# EasyEDA Pro project teensypixel.epro

# Schematic Adaptor Board
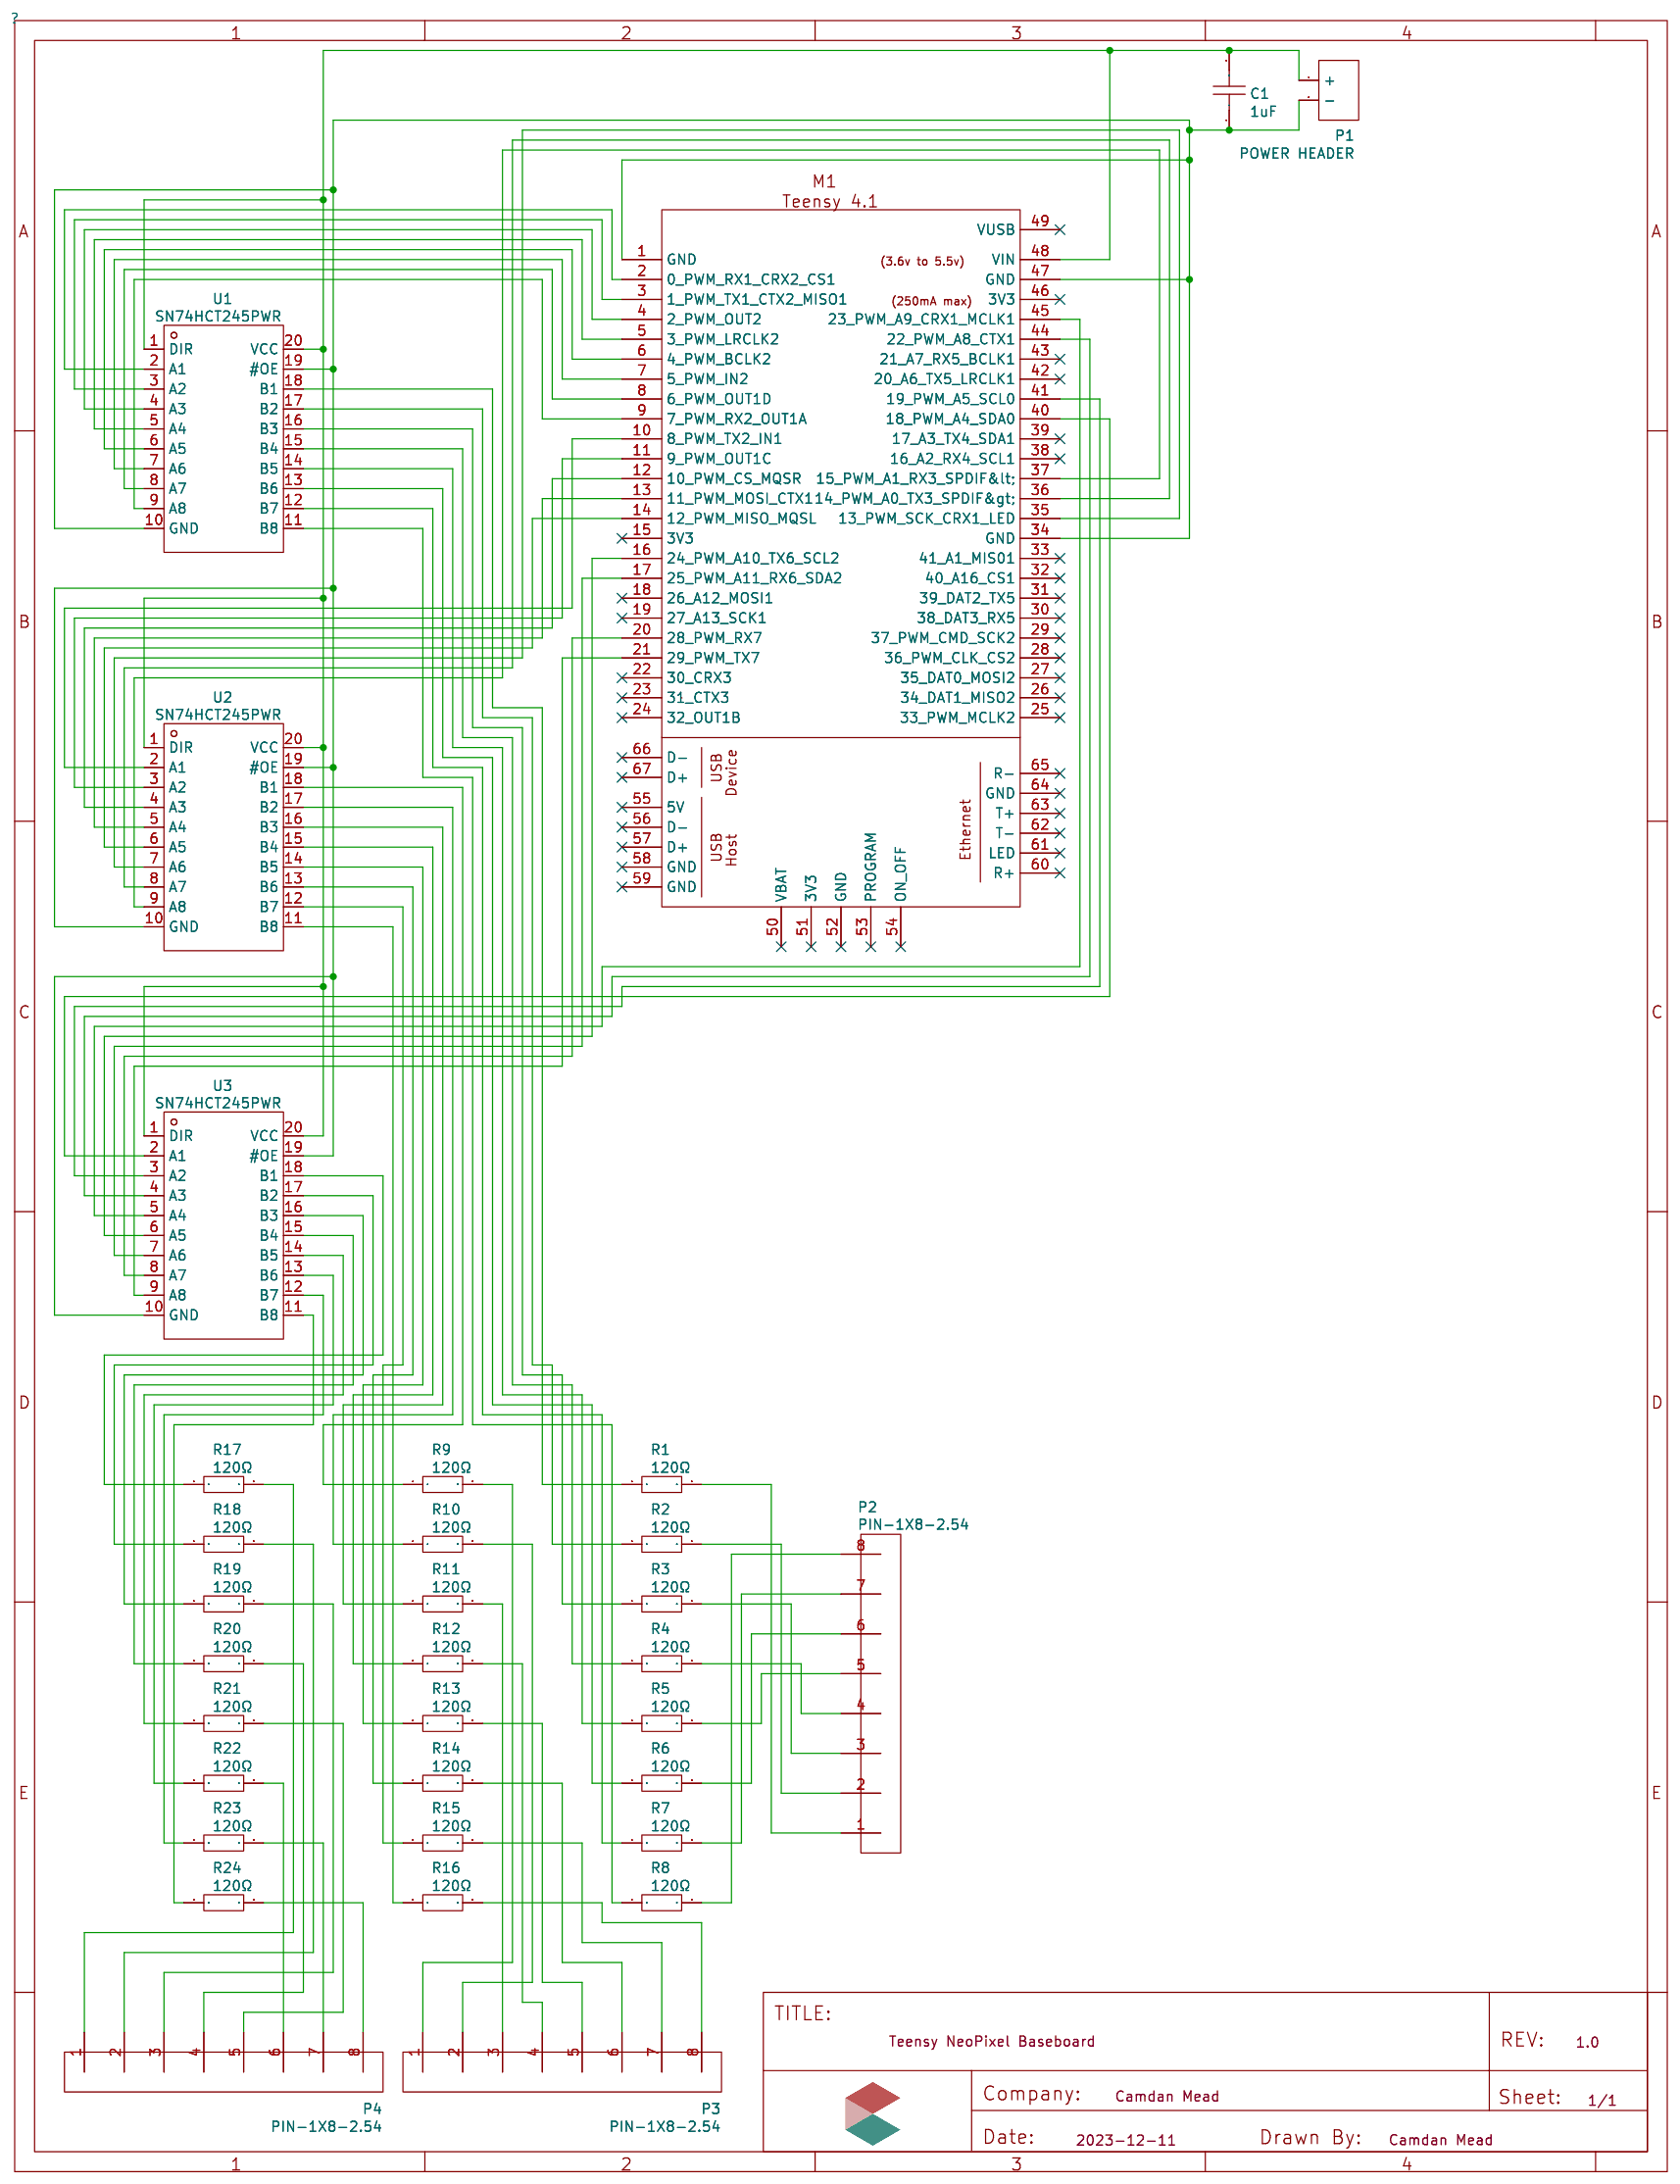
[diagram p0: schematic sheet]

## Parts
C1  1uF  [C0402]
P1  POWER HEADER  [POWER HEADER]
P2  PIN-1X8-2.54  [PIN-1X8-2.54]
P3  PIN-1X8-2.54  [PIN-1X8-2.54]
P4  PIN-1X8-2.54  [PIN-1X8-2.54]
R1  120Ω  [R0402]
R2  120Ω  [R0402]
R3  120Ω  [R0402]
R4  120Ω  [R0402]
R5  120Ω  [R0402]
R6  120Ω  [R0402]
R7  120Ω  [R0402]
R8  120Ω  [R0402]
R9  120Ω  [R0402]
R10  120Ω  [R0402]
R11  120Ω  [R0402]
R12  120Ω  [R0402]
R13  120Ω  [R0402]
R14  120Ω  [R0402]
R15  120Ω  [R0402]
R16  120Ω  [R0402]
R17  120Ω  [R0402]
R18  120Ω  [R0402]
R19  120Ω  [R0402]
R20  120Ω  [R0402]
R21  120Ω  [R0402]
R22  120Ω  [R0402]
R23  120Ω  [R0402]
R24  120Ω  [R0402]
U1  SN74HCT245PWR  [TSSOP-20_L6.5-W4.4-P0.65-LS6.4-BL]
U2  SN74HCT245PWR  [TSSOP-20_L6.5-W4.4-P0.65-LS6.4-BL]
U3  SN74HCT245PWR  [TSSOP-20_L6.5-W4.4-P0.65-LS6.4-BL]
U4  Teensy4.1 - KB

## Library data of the parts
C1 = 1uF: Supplier: LCSC; Manufacturer: SAMSUNG(三星); Manufacturer Part: CL05A105KA5NQNC; Supplier Part: C52923; JLCPCB Part Class: Basic Part
P1 = POWER HEADER: Supplier: LCSC; Manufacturer: BOOMELE; Manufacturer Part: 2.54-1*2PFemale; image: //image.lceda.cn/szlcsc/C49661.jpg; Supplier Part: C49661
P2-P4 = PIN-1X8-2.54
R1-R24 = 120Ω: Supplier: LCSC; Manufacturer: UNI-ROYAL(厚声); Manufacturer Part: 0402WGF1200TCE; Supplier Part: C25079; JLCPCB Part Class: Basic Part
U1-U3 = SN74HCT245PWR: Supplier: LCSC; Manufacturer: TI(德州仪器); Supplier Part: C6779; JLCPCB Part Class: Extended Part
U4 = Teensy4.1 - KB: Manufacturer: PJRC; Manufacturer Part: Teensy4.1; link: https://www.pjrc.com/store/teensy41.html

## Nets
Net-(C1-1): C1.1 P1.2(-) U1.10(GND) U1.19(#OE) U2.10(GND) U2.19(#OE) U3.10(GND) U3.19(#OE) U4.1(GND) U4.34(GND) U4.47(GND)
Net-(C1-2): C1.2 P1.1(+) U1.1(DIR) U1.20(VCC) U2.1(DIR) U2.20(VCC) U3.1(DIR) U3.20(VCC) U4.48(VIN)
Net-(P2-1): P2.1 R1.2
Net-(P2-2): P2.2 R2.2
Net-(P2-3): P2.3 R3.2
Net-(P2-4): P2.4 R4.2
Net-(P2-5): P2.5 R5.2
Net-(P2-6): P2.6 R6.2
Net-(P2-7): P2.7 R7.2
Net-(P2-8): P2.8 R8.2
Net-(P3-1): P3.1 R9.2
Net-(P3-2): P3.2 R10.2
Net-(P3-3): P3.3 R11.2
Net-(P3-4): P3.4 R12.2
Net-(P3-5): P3.5 R13.2
Net-(P3-6): P3.6 R14.2
Net-(P3-7): P3.7 R15.2
Net-(P3-8): P3.8 R16.2
Net-(P4-1): P4.1 R17.2
Net-(P4-2): P4.2 R18.2
Net-(P4-3): P4.3 R19.2
Net-(P4-4): P4.4 R20.2
Net-(P4-5): P4.5 R21.2
Net-(P4-6): P4.6 R22.2
Net-(P4-7): P4.7 R23.2
Net-(P4-8): P4.8 R24.2
Net-(U1-2): U1.2(A1) U4.2(0_PWM_RX1_CRX2_CS1)
Net-(U1-3): U1.3(A2) U4.3(1_PWM_TX1_CTX2_MISO1)
Net-(U1-4): U1.4(A3) U4.4(2_PWM_OUT2)
Net-(U1-5): U1.5(A4) U4.5(3_PWM_LRCLK2)
Net-(U1-6): U1.6(A5) U4.6(4_PWM_BCLK2)
Net-(U1-7): U1.7(A6) U4.7(5_PWM_IN2)
Net-(U1-8): U1.8(A7) U4.8(6_PWM_OUT1D)
Net-(U1-9): U1.9(A8) U4.9(7_PWM_RX2_OUT1A)
Net-(U2-2): U2.2(A1) U4.10(8_PWM_TX2_IN1)
Net-(U2-3): U2.3(A2) U4.11(9_PWM_OUT1C)
Net-(U2-4): U2.4(A3) U4.12(10_PWM_CS_MQSR)
Net-(U2-5): U2.5(A4) U4.13(11_PWM_MOSI_CTX1)
Net-(U2-6): U2.6(A5) U4.14(12_PWM_MISO_MQSL)
Net-(U2-7): U2.7(A6) U4.35(13_PWM_SCK_CRX1_LED)
Net-(U2-8): U2.8(A7) U4.36(14_PWM_A0_TX3_SPDIF&gt;)
Net-(U2-9): U2.9(A8) U4.37(15_PWM_A1_RX3_SPDIF&lt;)
Net-(U3-2): U3.2(A1) U4.40(18_PWM_A4_SDA0)
Net-(U3-3): U3.3(A2) U4.41(19_PWM_A5_SCL0)
Net-(U3-4): U3.4(A3) U4.44(22_PWM_A8_CTX1)
Net-(U3-5): U3.5(A4) U4.45(23_PWM_A9_CRX1_MCLK1)
Net-(U3-6): U3.6(A5) U4.16(24_PWM_A10_TX6_SCL2)
Net-(U3-7): U3.7(A6) U4.17(25_PWM_A11_RX6_SDA2)
Net-(U3-8): U3.8(A7) U4.20(28_PWM_RX7)
Net-(U3-9): U3.9(A8) U4.21(29_PWM_TX7)
U1_11: R8.1 U1.11(B8)
U1_12: R7.1 U1.12(B7)
U1_13: R6.1 U1.13(B6)
U1_14: R5.1 U1.14(B5)
U1_15: R4.1 U1.15(B4)
U1_16: R3.1 U1.16(B3)
U1_17: R2.1 U1.17(B2)
U1_18: R1.1 U1.18(B1)
U2_11: R16.1 U2.11(B8)
U2_12: R15.1 U2.12(B7)
U2_13: R14.1 U2.13(B6)
U2_14: R13.1 U2.14(B5)
U2_15: R12.1 U2.15(B4)
U2_16: R11.1 U2.16(B3)
U2_17: R10.1 U2.17(B2)
U2_18: R9.1 U2.18(B1)
U3_11: R24.1 U3.11(B8)
U3_12: R23.1 U3.12(B7)
U3_13: R22.1 U3.13(B6)
U3_14: R21.1 U3.14(B5)
U3_15: R20.1 U3.15(B4)
U3_16: R19.1 U3.16(B3)
U3_17: R18.1 U3.17(B2)
U3_18: R17.1 U3.18(B1)

Not connected (* = marked no-connect by the designer): U4 15(3V3)* 18(26_A12_MOSI1)* 19(27_A13_SCK1)* 22(30_CRX3)* 23(31_CTX3)* 24(32_OUT1B)* 25(33_PWM_MCLK2)* 26(34_DAT1_MISO2)* 27(35_DAT0_MOSI2)* 28(36_PWM_CLK_CS2)* 29(37_PWM_CMD_SCK2)* 30(38_DAT3_RX5)* 31(39_DAT2_TX5)* 32(40_A16_CS1)* 33(41_A1_MIS01)* 38(16_A2_RX4_SCL1)* 39(17_A3_TX4_SDA1)* 42(20_A6_TX5_LRCLK1)* 43(21_A7_RX5_BCLK1)* 46(3V3)* 49(VUSB)* 50(VBAT)* 51(3V3)* 52(GND)* 53(PROGRAM)* 54(ON_OFF)* 55(5V)* 56(D-)* 57(D+)* 58(GND)* 59(GND)* 60(R+)* 61(LED)* 62(T-)* 63(T+)* 64(GND)* 65(R-)* 66(D-)* 67(D+)*

# Schematic Adaptor Board rev 2
Create Date: 2025-02-11; Page Name: P1; Project Name: Teensy NeoPixel Baseboard; Schematic Name: Adaptor Board rev 2; Update Date: 2025-02-12; Company: Camdan Mead; Page Size: Letter; Version: V2.0
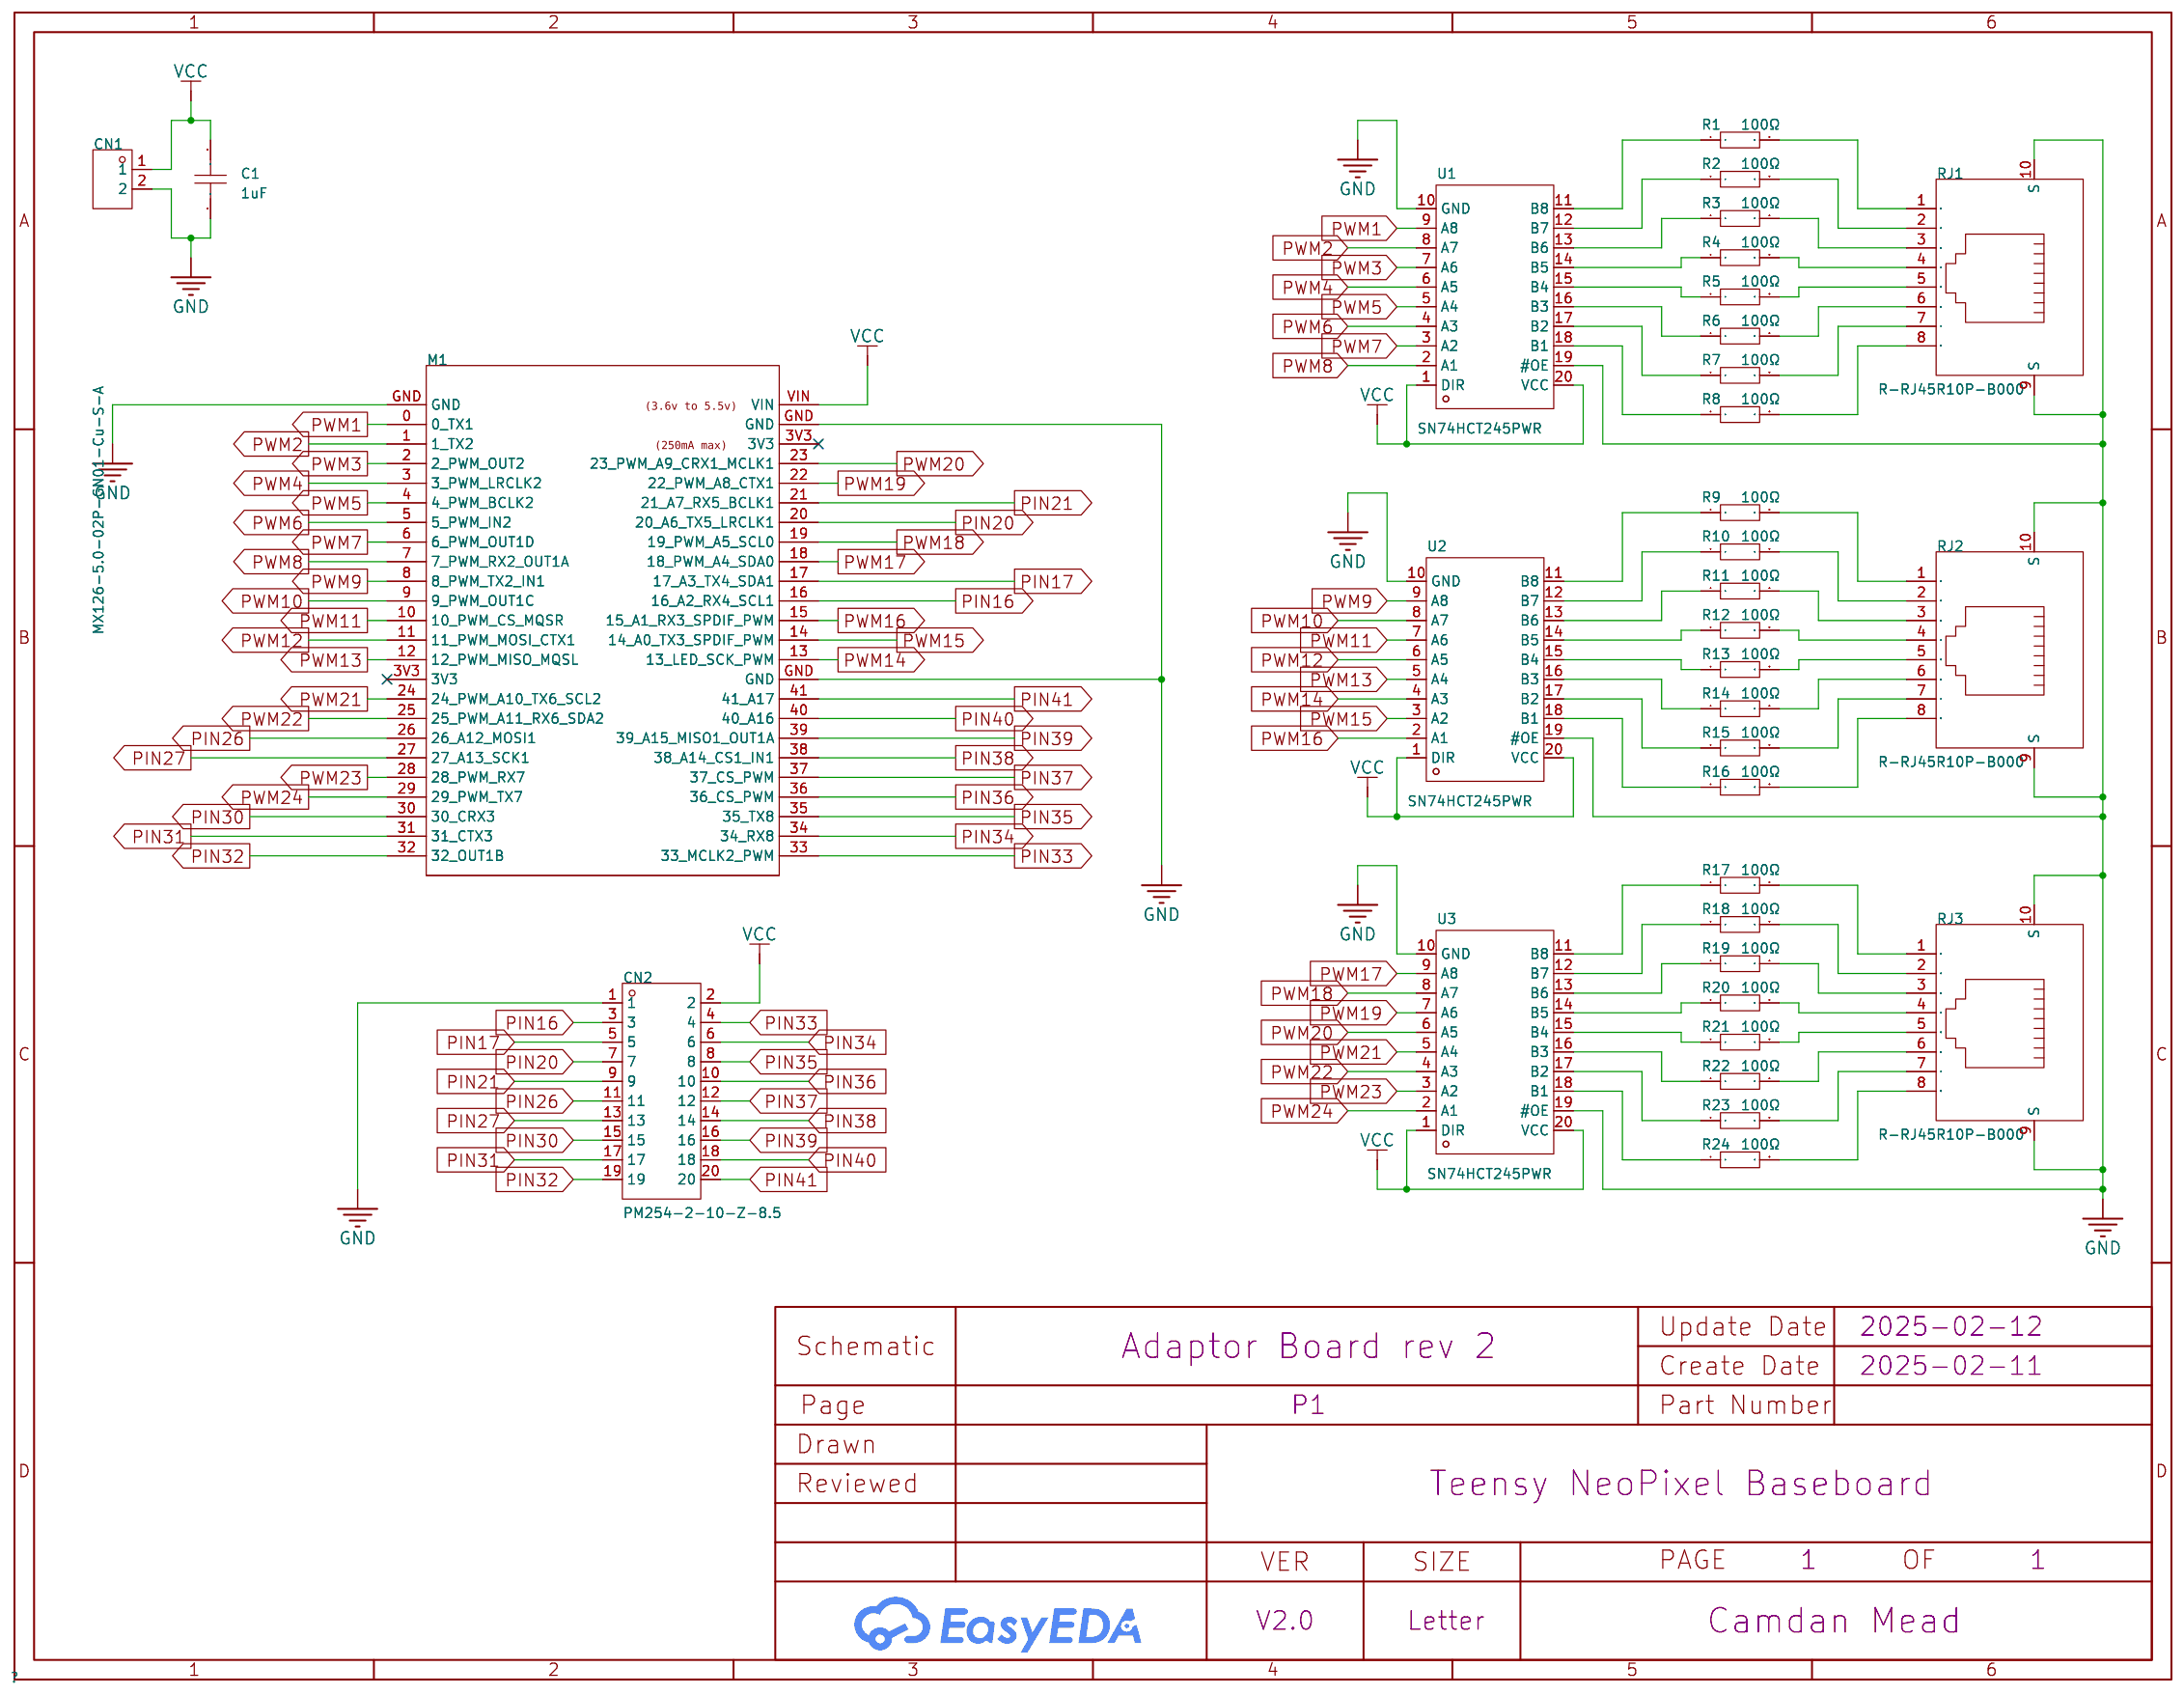
[diagram p1: schematic sheet]

## Parts
C1  1uF  [C0603]
CN1  MX126-5.0-02P-GN01-Cu-S-A  [CONN-TH_2P-P5.00_MX126-5.0-GN01-02P-CU-S-A]
CN2  PM254-2-10-Z-8.5  [HDR-TH_20P-P2.54-V-F-R2-C10-S2.54]
M1  -  [TEENSY4.1 - KBB]
R1  100Ω  [R0402]
R2  100Ω  [R0402]
R3  100Ω  [R0402]
R4  100Ω  [R0402]
R5  100Ω  [R0402]
R6  100Ω  [R0402]
R7  100Ω  [R0402]
R8  100Ω  [R0402]
R9  100Ω  [R0402]
R10  100Ω  [R0402]
R11  100Ω  [R0402]
R12  100Ω  [R0402]
R13  100Ω  [R0402]
R14  100Ω  [R0402]
R15  100Ω  [R0402]
R16  100Ω  [R0402]
R17  100Ω  [R0402]
R18  100Ω  [R0402]
R19  100Ω  [R0402]
R20  100Ω  [R0402]
R21  100Ω  [R0402]
R22  100Ω  [R0402]
R23  100Ω  [R0402]
R24  100Ω  [R0402]
RJ1  R-RJ45R10P-B000  [RJ45-TH_R-RJ45R10P-B000]
RJ2  R-RJ45R10P-B000  [RJ45-TH_R-RJ45R10P-B000]
RJ3  R-RJ45R10P-B000  [RJ45-TH_R-RJ45R10P-B000]
U1  SN74HCT245PWR  [TSSOP-20_L6.5-W4.4-P0.65-LS6.4-BL]
U2  SN74HCT245PWR  [TSSOP-20_L6.5-W4.4-P0.65-LS6.4-BL]
U3  SN74HCT245PWR  [TSSOP-20_L6.5-W4.4-P0.65-LS6.4-BL]

## Library data of the parts
C1 = CL10A105KB8NNNC: Capacitance: Tolerance:±10% Tolerance:±10% Voltage Rated: Temperature Coefficient:; LCSC Part Name: 1uF ±10% 50V; Supplier Part: C15849; Manufacturer: SAMSUNG(三星); Supplier Footprint: 0603; JLCPCB Part Class: Basic Part; Datasheet: https://atta.szlcsc.com/upload/public/pdf/source/20160218/1457707763339.pdf; Supplier: LCSC; Tolerance: ±10%
CN1 = MX126-5.0-02P-GN01-Cu-S-A: Structure:1x2P Pitch:5mm Color:Green Mounting Style:Direct Insert Number of Pins:2P Number of Rows:1 Number of PINs Per Row:2 Screw Specification:M2.5 Current Rating (Max):10A Voltage Rating (Max):300V Wire Gauge - AWG:14~26 Wire Gauge - AWG:14~26 Wire Ga; LCSC Part Name: 1x2P 5mm 直插 排数:1 每排P数:2; Supplier Part: C5188434; Manufacturer: MAX(迈旭); Supplier Footprint: 插件,P=5mm; JLCPCB Part Class: Extended Part; Datasheet: https://atta.szlcsc.com/upload/public/pdf/source/20230914/2B012B5258BE925E2417FA81B30CB923.pdf; Supplier: LCSC; Structure: 1x2P; Pitch: 5mm; Color: Green; Mounting Style: Direct Insert; Number of Pins: 2P; Number of Rows: 1; Number of PINs Per Row: 2; Screw Specification: M2.5; Current Rating (Max): 10A; Voltage Rating (Max): 300V; Wire Gauge - AWG: 14~26; Wire Gauge - mm2: 2.5; Operating Temperature Range: -40℃~+105℃
CN2 = PM254-2-10-Z-8.5: Holes Structure:2x10P Pitch:2.54mm Row Spacing:2.54mm Circular Hole / Square Hole:Square Holes Mounting Type:Straight Number of Rows:双排 Number of Holes:20P Current Rating (Max):3A Voltage Rating (Max):- Holes Direction:Top Insulation Height:8.5mm Contact; LCSC Part Name: 2x10P 间距:2.54mm 直插; Supplier Part: C2897411; Manufacturer: HCTL(华灿天禄); Supplier Footprint: 插件,P=2.54mm; JLCPCB Part Class: Extended Part; Datasheet: https://atta.szlcsc.com/upload/public/pdf/source/20230609/3D36CA2C1BFC9FD1C3F709AD9DFEB9C2.pdf; Supplier: LCSC; Holes Structure: 2x10P; Pitch: 2.54mm; Row Spacing: 2.54mm; Circular Hole / Square Hole: Square Holes; Mounting Type: Straight; Number of Rows: 双排; Number of Holes: 20P; Current Rating (Max): 3A; Holes Direction: Top; Insulation Height: 8.5mm; Contact Material: Copper Alloy; Operating Temperature Range: -40℃~+105℃; Soldering Temperature(Max): 260℃@5S
M1 = SCHLIB_TEENSY4.1_2022-12-14
R1-R24 = 0402WGF1000TCE: Type:Thick Film Resistors Resistance: Tolerance:±1% Tolerance:±1% Power(Watts): Overload Voltage (Max): Temperature Coefficient:±200ppm/℃ Temperature Coefficient:±200ppm/℃ Operating Temperature Range:-55℃~+155℃ Operating Temperature Range:-55℃~+155℃; LCSC Part Name: 100Ω ±1% 62.5mW 厚膜电阻; Supplier Part: C25076; Manufacturer: UNI-ROYAL(厚声); Supplier Footprint: 0402; JLCPCB Part Class: Basic Part; Datasheet: https://atta.szlcsc.com/upload/public/pdf/source/20200306/C422600_1E6D84923E4A46A82E41ADD87F860B5C.pdf; Supplier: LCSC; Type: Thick Film Resistors; Tolerance: ±1%; Temperature Coefficient: ±200ppm/℃; Operating Temperature Range: -55℃~+155℃
RJ1-RJ3 = R-RJ45R10P-B000: Connector Type:RJ45Receptacle Number of Ports:1 Mounting Style:Right-Angle Shielding:有屏蔽 LED:不带LED Ratings:- Operating Temperature Range:0℃~+70℃ Operating Temperature Range:0℃~+70℃; LCSC Part Name: 弯插 不带LED; Supplier Part: C386758; Manufacturer: Ckmtw(灿科盟); Supplier Footprint: 插件; JLCPCB Part Class: Extended Part; Datasheet: https://atta.szlcsc.com/upload/public/pdf/source/20190508/C386758_8CEE26A838080B089F94E7884BE94734.pdf; Supplier: LCSC; Connector Type: RJ45Receptacle; Number of Ports: 1; Mounting Style: Right-Angle; Shielding: 有屏蔽; LED: 不带LED; Operating Temperature Range: 0℃~+70℃
U1-U3 = SN74HCT245PWR: output type:Tri-State Supply Voltage:4.5V~5.5V Supply Voltage:4.5V~5.5V Number of Elements:1 Number of Bits per Element:8 Sink Current:6mA Source Current:6mA Logic Family:74HCT Operating Temperature:-40℃~+85℃ Operating Temperature:-40℃~+85℃; Supplier Part: C6779; Manufacturer: TI(德州仪器); Supplier Footprint: TSSOP-20; JLCPCB Part Class: Extended Part; Datasheet: https://www.ti.com/cn/lit/gpn/sn74hct245; Supplier: LCSC; output type: Tri-State; Supply Voltage: 4.5V~5.5V; Number of Elements: 1; Number of Bits per Element: 8; Sink Current: 6mA; Source Current: 6mA; Logic Family: 74HCT; Operating Temperature: -40℃~+85℃

## Nets
GND: C1.1 CN1.2 CN2.1 M1.GND RJ1.9(S) RJ1.10(S) RJ2.9(S) RJ2.10(S) RJ3.9(S) RJ3.10(S) U1.10(GND) U1.19(#OE) U2.10(GND) U2.19(#OE) U3.10(GND) U3.19(#OE)
VCC: C1.2 CN1.1 CN2.2 M1.VIN U1.1(DIR) U1.20(VCC) U2.1(DIR) U2.20(VCC) U3.1(DIR) U3.20(VCC)
PIN16: CN2.3 M1.16(16_A2_RX4_SCL1)
PIN17: CN2.5 M1.17(17_A3_TX4_SDA1)
PIN20: CN2.7 M1.20(20_A6_TX5_LRCLK1)
PIN21: CN2.9 M1.21(21_A7_RX5_BCLK1)
PIN26: CN2.11 M1.26(26_A12_MOSI1)
PIN27: CN2.13 M1.27(27_A13_SCK1)
PIN30: CN2.15 M1.30(30_CRX3)
PIN31: CN2.17 M1.31(31_CTX3)
PIN32: CN2.19 M1.32(32_OUT1B)
PIN33: CN2.4 M1.33(33_MCLK2_PWM)
PIN34: CN2.6 M1.34(34_RX8)
PIN35: CN2.8 M1.35(35_TX8)
PIN36: CN2.10 M1.36(36_CS_PWM)
PIN37: CN2.12 M1.37(37_CS_PWM)
PIN38: CN2.14 M1.38(38_A14_CS1_IN1)
PIN39: CN2.16 M1.39(39_A15_MISO1_OUT1A)
PIN40: CN2.18 M1.40(40_A16)
PIN41: CN2.20 M1.41(41_A17)
PWM1: M1.0(0 TX1) U1.9(A8)
PWM2: M1.1(1 TX2) U1.8(A7)
PWM3: M1.2(2_PWM_OUT2) U1.7(A6)
PWM4: M1.3(3_PWM_LRCLK2) U1.6(A5)
PWM5: M1.4(4_PWM_BCLK2) U1.5(A4)
PWM6: M1.5(5_PWM_IN2) U1.4(A3)
PWM7: M1.6(6_PWM_OUT1D) U1.3(A2)
PWM8: M1.7(7_PWM_RX2_OUT1A) U1.2(A1)
PWM9: M1.8(8_PWM_TX2_IN1) U2.9(A8)
PWM10: M1.9(9_PWM_OUT1C) U2.8(A7)
PWM11: M1.10(10_PWM_CS_MQSR) U2.7(A6)
PWM12: M1.11(11_PWM_MOSI_CTX1) U2.6(A5)
PWM13: M1.12(12_PWM_MISO_MQSL) U2.5(A4)
PWM14: M1.13(13_LED_SCK_PWM) U2.4(A3)
PWM15: M1.14(14_A0_TX3_SPDIF_PWM) U2.3(A2)
PWM16: M1.15(15_A1_RX3_SPDIF_PWM) U2.2(A1)
PWM17: M1.18(18_PWM_A4_SDA0) U3.9(A8)
PWM18: M1.19(19_PWM_A5_SCL0) U3.8(A7)
PWM19: M1.22(22_PWM_A8_CTX1) U3.7(A6)
PWM20: M1.23(23_PWM_A9_CRX1_MCLK1) U3.6(A5)
PWM21: M1.24(24_PWM_A10_TX6_SCL2) U3.5(A4)
PWM22: M1.25(25_PWM_A11_RX6_SDA2) U3.4(A3)
PWM23: M1.28(28_PWM_RX7) U3.3(A2)
PWM24: M1.29(29_PWM_TX7) U3.2(A1)
$1N2556: R6.1 U1.16(B3)
$1N2587: R4.2 RJ1.4
$1N2597: R5.2 RJ1.5
$1N2607: R6.2 RJ1.6
$1N2633: R2.2 RJ1.2
$1N2634: R3.2 RJ1.3
$1N2643: R1.2 RJ1.1
$1N2648: R7.2 RJ1.7
$1N2658: R8.2 RJ1.8
$1N3149: R10.1 U2.12(B7)
$1N3165: R12.2 RJ2.4
$1N3169: R13.2 RJ2.5
$1N3173: R14.2 RJ2.6
$1N3177: R10.2 RJ2.2
$1N3181: R11.2 RJ2.3
$1N3185: R9.2 RJ2.1
$1N3189: R16.2 RJ2.8
$1N3193: R15.2 RJ2.7
$1N3678: R20.2 RJ3.4
$1N3682: R21.2 RJ3.5
$1N3686: R22.2 RJ3.6
$1N3690: R18.2 RJ3.2
$1N3694: R19.2 RJ3.3
$1N3698: R17.2 RJ3.1
$1N3702: R24.2 RJ3.8
$1N3706: R23.2 RJ3.7
$1N9639: R1.1 U1.11(B8)
$1N9644: R2.1 U1.12(B7)
$1N9649: R3.1 U1.13(B6)
$1N9654: R4.1 U1.14(B5)
$1N9659: R5.1 U1.15(B4)
$1N9677: R7.1 U1.17(B2)
$1N9682: R8.1 U1.18(B1)
$1N9744: R9.1 U2.11(B8)
$1N9765: R11.1 U2.13(B6)
$1N9770: R12.1 U2.14(B5)
$1N9775: R13.1 U2.15(B4)
$1N9780: R14.1 U2.16(B3)
$1N9785: R15.1 U2.17(B2)
$1N9790: R16.1 U2.18(B1)
$1N9844: R17.1 U3.11(B8)
$1N9849: R18.1 U3.12(B7)
$1N9854: R19.1 U3.13(B6)
$1N9859: R20.1 U3.14(B5)
$1N9864: R21.1 U3.15(B4)
$1N9869: R22.1 U3.16(B3)
$1N9874: R23.1 U3.17(B2)
$1N9879: R24.1 U3.18(B1)

Not connected (* = marked no-connect by the designer): M1 3V3*

# Board PCB v1
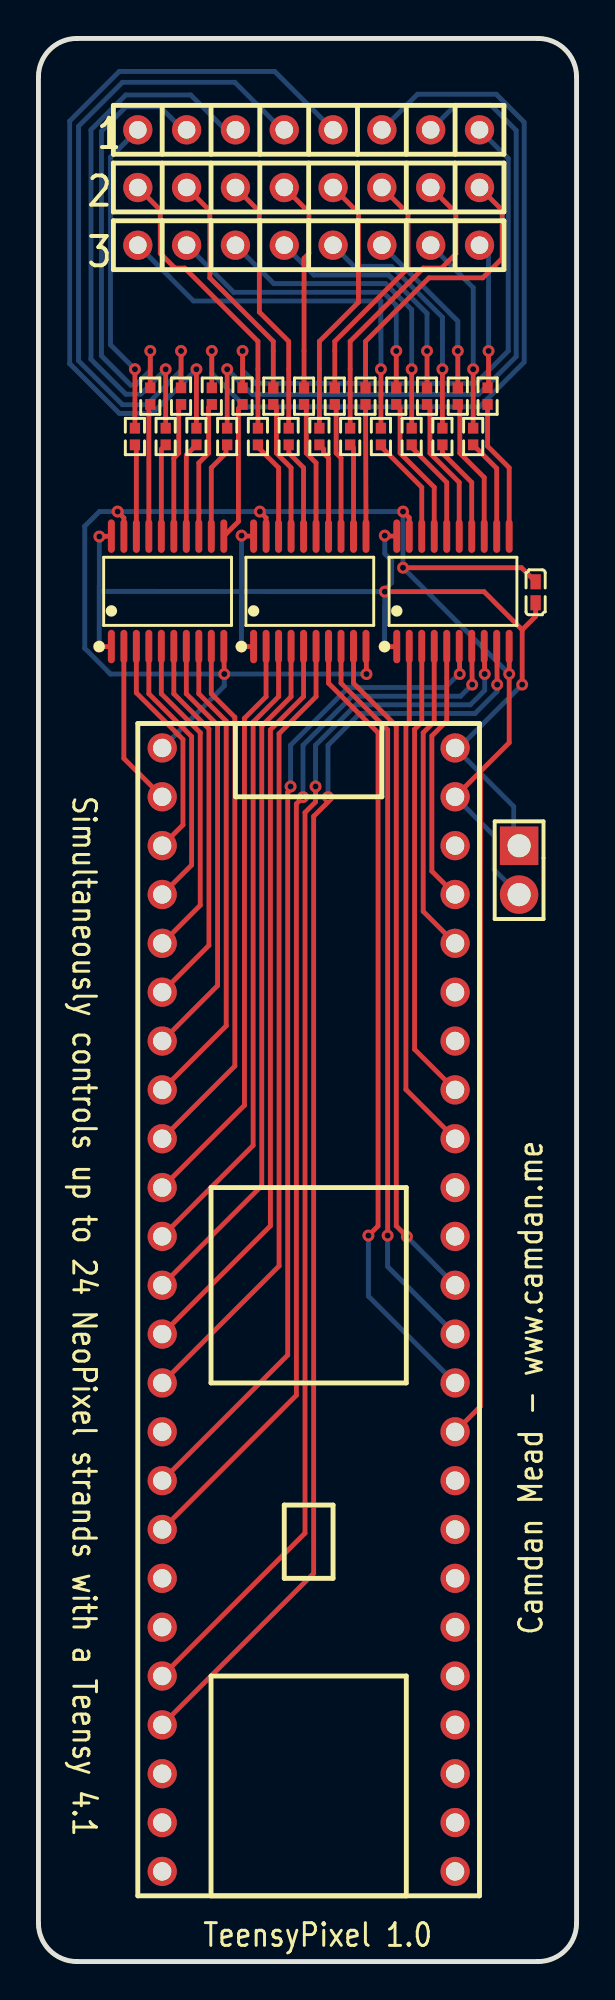
[diagram p2: board, top side]
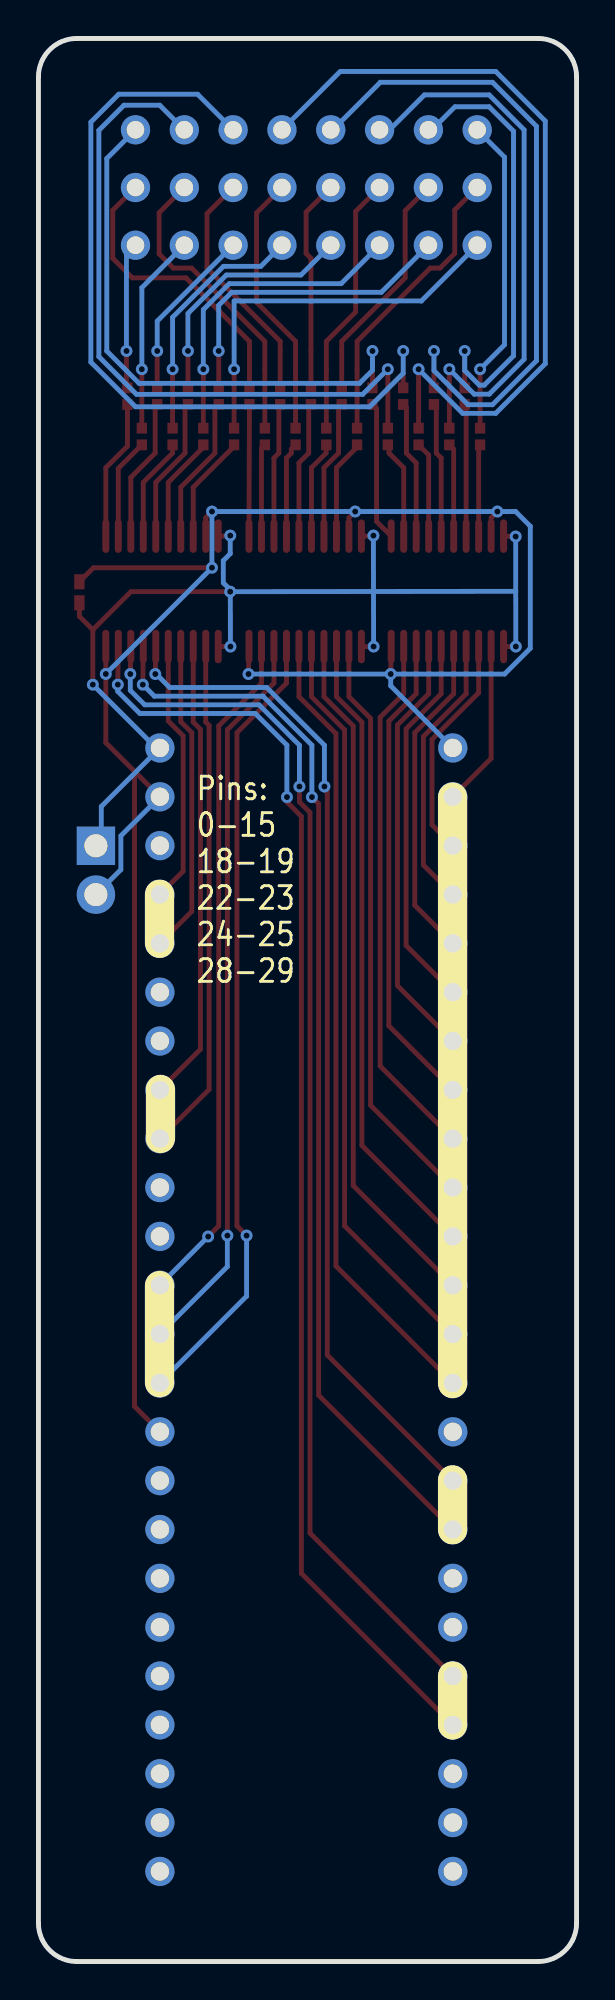
[diagram p3: board, bottom side, seen from below]

Outline 28 x 100 mm; copper layers: Top Layer, Bottom Layer. Coordinates in mm from the lower left corner of the outline.
Outline path: 0,98 arc(0.59,99.41) 2,100 26,100 arc(27.41,99.41) 28,98 28,2 arc(27.41,0.59) 26,0 2,0 arc(0.59,0.59) 0,2 0,98
Stack: Top Layer 0.035mm / Dielectric1 1.51mm FR4 er 4.5 / Bottom Layer 0.035mm

## Design rules (mm)
spacing Default (default): track to track 0.152, other pairs 0 to 0.152
track width Default (default): min 0.254, default 0.254, max 25.4
differential pair differentialPair (default): width min 0.127, default 0.254, max 2.54; gap min 0.152, default 0.152
via Default (default): diameter min 0.61, default 0.61, max 100.025; hole min 0.305, default 0.305, max 59.995

## Placement (name value [footprint] x y rotation side)
CAP  1uF  [C0402]  25.87 71.2 270 top
NOREF  -  [Pad_e915]  21.68 50.41 90 top
NOREF#2  -  [Pad_e930]  7.71 89.25 180 top
NOREF#3  -  [Pad_e916]  21.68 47.87 90 top
NOREF#4  -  [Pad_e938]  7.71 92.25 180 top
NOREF#5  -  [Pad_e933]  15.33 89.25 180 top
NOREF#6  -  [Pad_e890]  21.68 14.85 90 top
NOREF#7  -  [Pad_e914]  21.68 52.95 90 top
NOREF#8  -  [Pad_e887]  21.68 4.69 90 top
NOREF#9  -  [Pad_e912]  21.68 58.03 90 top
NOREF#10  -  [Pad_e911]  21.68 60.57 90 top
NOREF#11  -  [Pad_e932]  12.79 89.25 180 top
NOREF#12  -  [Pad_e883]  6.44 12.31 90 top
NOREF#13  -  [Pad_e929]  5.17 89.25 180 top
NOREF#14  -  [Pad_e919]  21.68 40.25 90 top
NOREF#15  -  [Pad_e921]  21.68 35.17 90 top
NOREF#16  -  [Pad_e894]  6.44 25.01 90 top
NOREF#17  -  [Pad_e895]  6.44 27.55 90 top
NOREF#18  -  [Pad_e937]  5.17 92.25 180 top
NOREF#19  -  [Pad_e888]  6.44 17.39 90 top
NOREF#20  -  [Pad_e902]  6.44 45.33 90 top
NOREF#21  -  [Pad_e918]  21.68 42.79 90 top
NOREF#22  -  [Pad_e905]  6.44 52.95 90 top
NOREF#23  -  [Pad_e909]  6.44 63.11 90 top
NOREF#24  -  [Pad_e897]  6.44 32.63 90 top
NOREF#25  -  [Pad_e892]  21.68 9.77 90 top
NOREF#26  -  [Pad_e901]  6.44 42.79 90 top
NOREF#27  -  [Pad_e931]  10.25 89.25 180 top
NOREF#28  -  [Pad_e917]  21.68 45.33 90 top
NOREF#29  -  [Pad_e928]  6.44 22.47 90 top
NOREF#30  -  [Pad_e900]  6.44 40.25 90 top
NOREF#31  -  [Pad_e944]  22.95 92.25 180 top
NOREF#32  -  [Pad_e896]  6.44 30.09 90 top
NOREF#33  -  [Pad_e942]  17.87 92.25 180 top
NOREF#34  -  [Pad_e885]  6.44 14.85 90 top
NOREF#35  -  [Pad_e881]  6.44 4.69 90 top
NOREF#36  -  [Pad_e924]  21.68 27.55 90 top
NOREF#37  -  [Pad_e882]  6.44 9.77 90 top
NOREF#38  -  [Pad_e936]  22.95 89.25 180 top
NOREF#39  -  [Pad_e925]  21.68 25.01 90 top
NOREF#40  -  [Pad_e886]  21.68 7.23 90 top
NOREF#41  -  [Pad_e927]  21.68 22.47 90 top
NOREF#42  -  [Pad_e939]  10.25 92.25 180 top
NOREF#43  -  [Pad_e908]  6.44 60.57 90 top
NOREF#44  -  [Pad_e891]  21.68 12.31 90 top
NOREF#45  -  [Pad_e910]  21.68 63.11 90 top
NOREF#46  -  [Pad_e899]  6.44 37.71 90 top
NOREF#47  -  [Pad_e903]  6.44 47.87 90 top
NOREF#48  -  [Pad_e943]  20.41 92.25 180 top
NOREF#49  -  [Pad_e904]  6.44 50.41 90 top
NOREF#50  -  [Pad_e898]  6.44 35.17 90 top
NOREF#51  -  [Pad_e922]  21.68 32.63 90 top
NOREF#52  -  [Pad_e935]  20.41 89.25 180 top
NOREF#53  -  [Pad_e884]  6.44 7.23 90 top
NOREF#54  -  [Pad_e926]  21.68 19.93 90 top
NOREF#55  -  [Pad_e940]  12.79 92.25 180 top
NOREF#56  -  [Pad_e889]  21.68 17.39 90 top
NOREF#57  -  [Pad_e934]  17.87 89.25 180 top
NOREF#58  -  [Pad_e923]  21.68 30.09 90 top
NOREF#59  -  [Pad_e941]  15.33 92.25 180 top
NOREF#60  -  [Pad_e920]  21.68 37.71 90 top
NOREF#61  -  [Pad_e913]  21.68 55.49 90 top
NOREF#62  -  [Pad_e893]  6.44 19.93 90 top
NOREF#63  -  [Pad_e907]  6.44 58.03 90 top
NOREF#64  -  [Pad_e906]  6.44 55.49 90 top
P1  POWER HEADER  [PIN-1X8-2.54]  5.17 95.25 180 top
PWR  -  [POWER HEADER]  25.01 56.75 270 top
R1  120Ω  [R0402]  5.02 79.3 90 top
R2  120Ω  [R0402]  5.82 81.4 90 top
R3  120Ω  [R0402]  6.62 79.3 90 top
R4  120Ω  [R0402]  7.42 81.4 90 top
R5  120Ω  [R0402]  8.22 79.3 90 top
R6  120Ω  [R0402]  9.02 81.4 90 top
R7  120Ω  [R0402]  9.82 79.3 90 top
R8  120Ω  [R0402]  10.62 81.4 90 top
R9  120Ω  [R0402]  11.42 79.3 90 top
R10  120Ω  [R0402]  12.22 81.4 90 top
R11  120Ω  [R0402]  13.02 79.3 90 top
R12  120Ω  [R0402]  13.82 81.4 90 top
R13  120Ω  [R0402]  14.62 79.3 90 top
R14  120Ω  [R0402]  15.42 81.4 90 top
R15  120Ω  [R0402]  16.22 79.3 90 top
R16  120Ω  [R0402]  17.02 81.4 90 top
R17  120Ω  [R0402]  17.82 79.3 90 top
R18  120Ω  [R0402]  18.62 81.4 90 top
R19  120Ω  [R0402]  19.42 79.3 90 top
R20  120Ω  [R0402]  20.22 81.4 90 top
R21  120Ω  [R0402]  21.02 79.3 90 top
R22  120Ω  [R0402]  21.82 81.4 90 top
R23  120Ω  [R0402]  22.62 79.3 90 top
R24  120Ω  [R0402]  23.37 81.4 90 top
U1  SN74HCT245PWR  [TSSOP-20_L6.5-W4.4-P0.65-LS6.4-BL]  6.72 71.25 0 top
U2  SN74HCT245PWR  [TSSOP-20_L6.5-W4.4-P0.65-LS6.4-BL]  14.12 71.25 0 top
U3  SN74HCT245PWR  [TSSOP-20_L6.5-W4.4-P0.65-LS6.4-BL]  21.57 71.25 0 top

## Footprints (pads in the part's own frame, mm; a bottom-side part is the same pattern mirrored in y, then rotated)
C0402
  rect 0.79x0.54 smd: 1(-0.545,0) 2(0.545,0)
Pad_e881
  round 1.524 hole 0.955x0.95: 24(0,0)
Pad_e882
  round 1.524 hole 0.955x0.95: 22(0,0)
Pad_e883
  round 1.524 hole 0.955x0.95: 21(0,0)
Pad_e884
  round 1.524 hole 0.955x0.95: 23(0,0)
Pad_e885
  round 1.524 hole 0.955x0.95: 20(0,0)
Pad_e886
  round 1.524 hole 0.955x0.95: 26(0,0)
Pad_e887
  round 1.524 hole 0.955x0.95: 25(0,0)
Pad_e888
  round 1.524 hole 0.955x0.95: 19(0,0)
Pad_e889
  round 1.524 hole 0.955x0.95: 30(0,0)
Pad_e890
  round 1.524 hole 0.955x0.95: 29(0,0)
Pad_e891
  round 1.524 hole 0.955x0.95: 28(0,0)
Pad_e892
  round 1.524 hole 0.955x0.95: 27(0,0)
Pad_e893
  round 1.524 hole 0.955x0.95: 18(0,0)
Pad_e894
  round 1.524 hole 0.955x0.95: 16(0,0)
Pad_e895
  round 1.524 hole 0.955x0.95: 15(0,0)
Pad_e896
  round 1.524 hole 0.955x0.95: 14(0,0)
Pad_e897
  round 1.524 hole 0.955x0.95: 13(0,0)
Pad_e898
  round 1.524 hole 0.955x0.95: 12(0,0)
Pad_e899
  round 1.524 hole 0.955x0.95: 11(0,0)
Pad_e900
  round 1.524 hole 0.955x0.95: 10(0,0)
Pad_e901
  round 1.524 hole 0.955x0.95: 9(0,0)
Pad_e902
  round 1.524 hole 0.955x0.95: 8(0,0)
Pad_e903
  round 1.524 hole 0.955x0.95: 7(0,0)
Pad_e904
  round 1.524 hole 0.955x0.95: 6(0,0)
Pad_e905
  round 1.524 hole 0.955x0.95: 5(0,0)
Pad_e906
  round 1.524 hole 0.955x0.95: 4(0,0)
Pad_e907
  round 1.524 hole 0.955x0.95: 3(0,0)
Pad_e908
  round 1.524 hole 0.955x0.95: 2(0,0)
Pad_e909
  round 1.524 hole 0.955x0.95: 1(0,0)
Pad_e910
  round 1.524 hole 0.955x0.95: 48(0,0)
Pad_e911
  round 1.524 hole 0.955x0.95: 47(0,0)
Pad_e912
  round 1.524 hole 0.955x0.95: 46(0,0)
Pad_e913
  round 1.524 hole 0.955x0.95: 45(0,0)
Pad_e914
  round 1.524 hole 0.955x0.95: 44(0,0)
Pad_e915
  round 1.524 hole 0.955x0.95: 43(0,0)
Pad_e916
  round 1.524 hole 0.955x0.95: 42(0,0)
Pad_e917
  round 1.524 hole 0.955x0.95: 41(0,0)
Pad_e918
  round 1.524 hole 0.955x0.95: 40(0,0)
Pad_e919
  round 1.524 hole 0.955x0.95: 39(0,0)
Pad_e920
  round 1.524 hole 0.955x0.95: 38(0,0)
Pad_e921
  round 1.524 hole 0.955x0.95: 37(0,0)
Pad_e922
  round 1.524 hole 0.955x0.95: 36(0,0)
Pad_e923
  round 1.524 hole 0.955x0.95: 35(0,0)
Pad_e924
  round 1.524 hole 0.955x0.95: 34(0,0)
Pad_e925
  round 1.524 hole 0.955x0.95: 33(0,0)
Pad_e926
  round 1.524 hole 0.955x0.95: 31(0,0)
Pad_e927
  round 1.524 hole 0.955x0.95: 32(0,0)
Pad_e928
  round 1.524 hole 0.955x0.95: 17(0,0)
Pad_e929
  round 1.524 hole 0.914: 1(0,0)
Pad_e930
  round 1.524 hole 0.914: 2(0,0)
Pad_e931
  round 1.524 hole 0.914: 3(0,0)
Pad_e932
  round 1.524 hole 0.914: 4(0,0)
Pad_e933
  round 1.524 hole 0.914: 5(0,0)
Pad_e934
  round 1.524 hole 0.914: 6(0,0)
Pad_e935
  round 1.524 hole 0.914: 7(0,0)
Pad_e936
  round 1.524 hole 0.914: 8(0,0)
Pad_e937
  round 1.524 hole 0.914: 1(0,0)
Pad_e938
  round 1.524 hole 0.914: 2(0,0)
Pad_e939
  round 1.524 hole 0.914: 3(0,0)
Pad_e940
  round 1.524 hole 0.914: 4(0,0)
Pad_e941
  round 1.524 hole 0.914: 5(0,0)
Pad_e942
  round 1.524 hole 0.914: 6(0,0)
Pad_e943
  round 1.524 hole 0.914: 7(0,0)
Pad_e944
  round 1.524 hole 0.914: 8(0,0)
PIN-1X8-2.54
  round 1.524 hole 0.914: 1(0,0) 2(-2.54,0) 3(-5.08,0) 4(-7.62,0) 5(-10.16,0) 6(-12.7,0) 7(-15.24,0) 8(-17.78,0)
POWER HEADER
  rect 2x2 hole 1.2: 1(-1.27,0)
  round 2 hole 1.2: 2(1.27,0)
R0402
  rect 0.566x0.54 smd: 1(-0.433,0) 2(0.433,0)
TSSOP-20_L6.5-W4.4-P0.65-LS6.4-BL
  oval 0.364x1.742 smd: 1(-2.925,-2.871) 2(-2.275,-2.871) 3(-1.625,-2.871) 4(-0.975,-2.871) 5(-0.325,-2.871) 6(0.325,-2.871) 7(0.975,-2.871) 8(1.625,-2.871) 9(2.275,-2.871) 10(2.925,-2.871) 11(2.925,2.871) 12(2.275,2.871) 13(1.625,2.871) 14(0.975,2.871) 15(0.325,2.871) 16(-0.325,2.871) 17(-0.975,2.871) 18(-1.625,2.871) 19(-2.275,2.871) 20(-2.925,2.871)

## Nets
P2_1: P1.1 R1.2
P2_2: P1.2 R2.2
P2_3: P1.3 R3.2
P2_4: P1.4 R4.2
P2_5: P1.5 R5.2
P2_6: P1.6 R6.2
P2_7: P1.7 R7.2
P2_8: P1.8 R8.2
P3_1: NOREF#18.1 R9.2
P3_2: NOREF#4.2 R10.2
P3_3: NOREF#42.3 R11.2
P3_4: NOREF#55.4 R12.2
P3_5: NOREF#59.5 R13.2
P3_6: NOREF#33.6 R14.2
P3_7: NOREF#48.7 R15.2
P3_8: NOREF#31.8 R16.2
P4_1: NOREF#13.1 R17.2
P4_2: NOREF#2.2 R18.2
P4_3: NOREF#27.3 R19.2
P4_4: NOREF#11.4 R20.2
P4_5: NOREF#5.5 R21.2
P4_6: NOREF#57.6 R22.2
P4_7: NOREF#52.7 R23.2
P4_8: NOREF#38.8 R24.2
U1_1: CAP.2 NOREF#45.48 PWR.1 U1.1 U1.20 U2.1 U2.20 U3.1 U3.20
U1_2: NOREF#43.2 U1.2
U1_3: NOREF#63.3 U1.3
U1_4: NOREF#64.4 U1.4
U1_5: NOREF#22.5 U1.5
U1_6: NOREF#49.6 U1.6
U1_7: NOREF#47.7 U1.7
U1_8: NOREF#20.8 U1.8
U1_9: NOREF#26.9 U1.9
U1_10: CAP.1 NOREF#10.47 NOREF#23.1 NOREF#36.34 PWR.2 U1.10 U1.19 U2.10 U2.19 U3.10 U3.19
U1_11: R8.1 U1.11
U1_12: R7.1 U1.12
U1_13: R6.1 U1.13
U1_14: R5.1 U1.14
U1_15: R4.1 U1.15
U1_16: R3.1 U1.16
U1_17: R2.1 U1.17
U1_18: R1.1 U1.18
U2_2: NOREF#30.10 U2.2
U2_3: NOREF#46.11 U2.3
U2_4: NOREF#50.12 U2.4
U2_5: NOREF#24.13 U2.5
U2_6: NOREF#32.14 U2.6
U2_7: NOREF#58.35 U2.7
U2_8: NOREF#51.36 U2.8
U2_9: NOREF#15.37 U2.9
U2_11: R16.1 U2.11
U2_12: R15.1 U2.12
U2_13: R14.1 U2.13
U2_14: R13.1 U2.14
U2_15: R12.1 U2.15
U2_16: R11.1 U2.16
U2_17: R10.1 U2.17
U2_18: R9.1 U2.18
U3_2: NOREF#21.40 U3.2
U3_3: NOREF#28.41 U3.3
U3_4: NOREF#7.44 U3.4
U3_5: NOREF#61.45 U3.5
U3_6: NOREF#16.16 U3.6
U3_7: NOREF#29.17 U3.7
U3_8: NOREF#34.20 U3.8
U3_9: NOREF#12.21 U3.9
U3_11: R24.1 U3.11
U3_12: R23.1 U3.12
U3_13: R22.1 U3.13
U3_14: R21.1 U3.14
U3_15: R20.1 U3.15
U3_16: R19.1 U3.16
U3_17: R18.1 U3.17
U3_18: R17.1 U3.18

Pads without a net: NOREF 43; NOREF#3 42; NOREF#6 29; NOREF#8 25; NOREF#9 46; NOREF#14 39; NOREF#17 15; NOREF#19 19; NOREF#25 27; NOREF#35 24; NOREF#37 22; NOREF#39 33; NOREF#40 26; NOREF#41 32; NOREF#44 28; NOREF#53 23; NOREF#54 31; NOREF#56 30; NOREF#60 38; NOREF#62 18

## Via types
v1: diameter 0.62, hole 0.31, Top Layer to Bottom Layer, 42 vias

## Routing (per net, layer and track width the routed paths; a pad name or vN(x,y) marks a point on that pad's centre or on a via; arc(x,y) is an arc through that point)
P2_1: length 16.6
  Top Layer w0.254: R1.2 v1(5.02,82.8)
  Bottom Layer w0.254: v1(5.02,82.8) 3.75,84.07 3.75,93.83 P1.1
P2_2: length 23.6
  Top Layer w0.254: 5.82,81.83 v1(5.82,83.75)
  Bottom Layer w0.254: P1.2 7.53,95.25 6.33,96.45 4.55,96.45 3.28,95.18 3.28,83.5 4.8,81.97 5.06,81.97 5.82,82.73 v1(5.82,83.75)
P2_3: length 29.2
  Top Layer w0.254: R3.2 v1(6.62,82.8)
  Bottom Layer w0.254: P1.3 9.73,95.25 7.92,97.06 4.54,97.06 2.73,95.25 2.73,83.32 4.54,81.5 5.32,81.5 v1(6.62,82.8)
P2_4: length 34.8
  Top Layer w0.254: 7.42,81.83 v1(7.42,83.75)
  Bottom Layer w0.254: v1(7.42,83.75) 7.42,82.73 5.64,80.96 4.37,80.96 2.09,83.24 2.09,95.43 4.37,97.72 10.21,97.72 12.68,95.25 P1.4
P2_5: length 40.3
  Top Layer w0.254: R5.2 v1(8.22,82.8)
  Bottom Layer w0.254: v1(8.22,82.8) 5.93,80.51 4.21,80.51 1.62,83.09 1.62,95.7 4.21,98.28 12.3,98.28 P1.5
P2_6: length 42.3
  Top Layer w0.254: 9.02,81.83 v1(9.02,83.75)
  Bottom Layer w0.254: P1.6 19.72,97.1 23.82,97.1 25.27,95.65 25.27,83.17 22.95,80.85 10.76,80.85 9.02,82.59 v1(9.02,83.75)
P2_7: length 36.7
  Top Layer w0.254: R7.2 v1(9.82,82.8)
  Bottom Layer w0.254: P1.7 21.69,96.53 23.55,96.53 24.86,95.22 24.86,83.45 22.9,81.49 11.13,81.49 v1(9.82,82.8)
P2_8: length 29.9
  Top Layer w0.254: 10.62,81.83 v1(10.62,83.75)
  Bottom Layer w0.254: P1.8 24.45,93.75 24.45,83.75 22.76,82.06 11.29,82.06 10.62,82.74 v1(10.62,83.75)
P3_1: length 15.4
  Top Layer w0.254: R9.2 11.42,84.25 7.61,88.06 7.1,88.06 6.34,88.82 6.34,91.08 NOREF#18.1
P3_2: length 12.3
  Top Layer w0.254: NOREF#4.2 8.92,91.04 8.92,87.55 12.22,84.25 12.22,81.83
P3_3: length 13.7
  Top Layer w0.254: R11.2 13.02,84.25 11.5,85.77 11.5,91 NOREF#42.3
P3_4: length 11.1
  Top Layer w0.254: 13.82,81.83 13.82,88.57 14.07,88.82 14.07,90.97 NOREF#55.4
P3_5: length 13.9
  Top Layer w0.254: NOREF#59.5 16.65,90.93 16.65,86.28 14.62,84.25 R13.2
P3_6: length 12.6
  Top Layer w0.254: 15.42,81.83 15.42,84.25 19.23,88.06 19.23,90.89 NOREF#33.6
P3_7: length 15.9
  Top Layer w0.254: NOREF#48.7 21.72,90.94 21.72,88.8 20.98,88.06 20.03,88.06 16.22,84.25 R15.2
P3_8: length 15.5
  Top Layer w0.254: 17.02,81.83 17.02,84.25 20.32,87.55 23.12,87.55 24.13,88.57 24.13,91.07 NOREF#31.8
P4_1: length 20.5
  Top Layer w0.254: R17.2 v1(17.82,82.8)
  Bottom Layer w0.254: 5.17,89.25 8.07,86.35 17.82,86.35 v1(17.82,82.8)
P4_2: length 16.5
  Top Layer w0.254: 18.62,81.83 v1(18.62,83.75)
  Bottom Layer w0.254: v1(18.62,83.75) 18.62,86.12 17.94,86.8 10.16,86.8 NOREF#2.2
P4_3: length 16.7
  Top Layer w0.254: R19.2 v1(19.42,82.8)
  Bottom Layer w0.254: v1(19.42,82.8) 19.42,85.9 18.07,87.25 12.25,87.25 NOREF#27.3
P4_4: length 12.8
  Top Layer w0.254: 20.22,81.83 v1(20.22,83.75)
  Bottom Layer w0.254: NOREF#11.4 14.34,87.7 18.22,87.7 20.22,85.7 v1(20.22,83.75)
P4_5: length 13
  Top Layer w0.254: R21.2 v1(21.02,82.8)
  Bottom Layer w0.254: v1(21.02,82.8) 21.02,85.5 18.37,88.15 16.43,88.15 NOREF#5.5
P4_6: length 9.1
  Top Layer w0.254: 21.82,81.83 v1(21.82,83.75)
  Bottom Layer w0.254: NOREF#57.6 21.82,85.3 v1(21.82,83.75)
P4_7: length 10.4
  Top Layer w0.254: R23.2 v1(22.62,82.8)
  Bottom Layer w0.254: v1(22.62,82.8) 22.62,87.04 NOREF#52.7
P4_8: length 7.6
  Top Layer w0.254: v1(23.42,83.75) 23.42,81.88 23.37,81.83
  Bottom Layer w0.254: v1(23.42,83.75) 23.42,88.78 NOREF#38.8
U1_1: length 60.1
  Top Layer w0.254: 11.2,74.12 10.6,74.12 10.57,74.15 ; v1(3.17,74.1) 3.79,74.12 ; v1(10.56,68.38) U2.1 ; v1(18.02,71.23) 23.19,71.23 25.17,69.25 ; 25.17,69.25 v1(25.17,66.4) ; 25.17,69.25 25.87,69.95 CAP.2 ; 18.65,74.12 18.05,74.12 v1(18.02,74.15) ; v1(18.01,68.38) 18.65,68.38 ; U1.1 v1(3.16,68.38)
  Bottom Layer w0.254: 18.02,71.23 v1(18.02,71.23) ; 18.02,71.23 18.02,71.33 18.38,71.69 18.38,72.85 18.02,73.21 v1(18.02,74.15) ; 18.02,71.23 10.57,71.24 ; 18.02,71.23 v1(18.01,68.38) ; v1(3.17,74.1) 3.16,68.38 ; v1(25.17,66.4) 21.88,63.11 NOREF#45.48 24.73,60.06 24.73,58.3 PWR.1 ; 3.17,71.25 10.57,71.24 ; 10.57,71.24 10.57,74.15 ; 10.57,71.24 v1(10.56,68.38)
  vias: v1(10.57,74.15)
U1_2: length 8.6
  Top Layer w0.254: NOREF#43.2 4.44,62.56 U1.2
U1_3: length 11.8
  Top Layer w0.254: NOREF#63.3 7.52,59.11 7.52,63.55 5.09,65.97 U1.3
U1_4: length 14.4
  Top Layer w0.254: U1.4 5.75,65.92 7.97,63.7 7.97,57.02 NOREF#64.4
U1_5: length 17.1
  Top Layer w0.254: NOREF#22.5 8.42,54.93 8.42,63.9 6.4,65.92 U1.5
U1_6: length 19.7
  Top Layer w0.254: NOREF#49.6 8.87,52.84 8.87,64.1 7.04,65.92 U1.6
U1_7: length 22.4
  Top Layer w0.254: U1.7 7.69,65.92 9.32,64.3 9.32,50.75 NOREF#47.7
U1_8: length 25
  Top Layer w0.254: U1.8 8.34,65.92 9.77,64.5 9.77,48.66 NOREF#20.8
U1_9: length 27.7
  Top Layer w0.254: NOREF#26.9 10.22,46.57 10.22,64.7 9,65.92 U1.9
U1_10: length 119
  Top Layer w0.254: U2.10 17.07,66.95 ; v1(18.97,75.4) 19.29,75.08 U3.19 ; U3.10 v1(24.5,66.95) 24.5,63.38 NOREF#10.47 ; v1(18.97,72.48) 25.14,72.48 CAP.1 ; 23,61.87 23,28.87 NOREF#36.34 ; U1.10 9.67,66.95 ; U2.19 11.84,75.08 v1(11.52,75.4) ; v1(4.12,75.4) 4.44,75.07 4.44,74.12
  Bottom Layer w0.254: v1(17.07,66.95) v1(9.67,66.95) ; v1(9.67,66.95) 9.67,66.34 NOREF#23.1 ; v1(9.67,66.95) 3.75,66.95 2.41,68.29 2.41,74.64 3.17,75.4 v1(4.12,75.4) v1(18.97,75.4) v1(18.97,72.48) v1(24.5,66.95) ; PWR.2 23.71,56.78 23.71,58.53 NOREF#10.47
U1_11: length 7.3
  Top Layer w0.254: R8.1 10.41,80.75 10.41,74.88 U1.11
U1_12: length 5.1
  Top Layer w0.254: 9.82,78.87 9.76,78.8 9.76,78.44 9,77.68 U1.12
U1_13: length 7.1
  Top Layer w0.254: U1.13 8.34,77.93 8.85,78.44 8.85,80.8 R6.1
U1_14: length 5
  Top Layer w0.254: U1.14 7.69,78.34 8.22,78.87
U1_15: length 7
  Top Layer w0.254: R4.1 7.3,80.85 7.3,78.44 7.04,78.19 U1.15
U1_16: length 4.8
  Top Layer w0.254: U1.16 6.4,78.64 6.62,78.87
U1_17: length 6.9
  Top Layer w0.254: R2.1 5.75,80.89 U1.17
U1_18: length 4.8
  Top Layer w0.254: 5.02,78.87 5.09,78.79 U1.18
U2_2: length 30.4
  Top Layer w0.254: NOREF#30.10 10.72,44.53 10.72,64.65 11.84,65.78 U2.2
U2_3: length 33.2
  Top Layer w0.254: NOREF#46.11 11.17,42.44 11.17,64.45 12.5,65.78 U2.3
U2_4: length 36
  Top Layer w0.254: U2.4 13.15,65.78 11.62,64.25 11.62,40.35 NOREF#50.12
U2_5: length 38.8
  Top Layer w0.254: NOREF#24.13 12.07,38.26 12.07,64.05 13.79,65.78 U2.5
U2_6: length 41.6
  Top Layer w0.254: U2.6 14.44,65.78 12.52,63.85 12.52,36.17 NOREF#32.14
U2_7: length 41.4
  Top Layer w0.254: v1(17.17,37.75) 17.67,38.25 17.67,63.9 15.09,66.47 15.09,68.38
  Bottom Layer w0.254: NOREF#58.35 17.17,34.6 v1(17.17,37.75)
U2_8: length 38.2
  Top Layer w0.254: U2.8 15.75,66.47 18.17,64.05 v1(18.17,37.75)
  Bottom Layer w0.254: NOREF#51.36 18.17,36.14 v1(18.17,37.75)
U2_9: length 35.4
  Top Layer w0.254: U2.9 16.4,66.47 18.62,64.25 18.62,38.25 v1(19.17,37.7)
  Bottom Layer w0.254: 19.17,37.7 NOREF#15.37
U2_11: length 6.8
  Top Layer w0.254: 17.05,74.12 R16.1
U2_12: length 4.8
  Top Layer w0.254: 16.22,78.87 16.4,78.69 U2.12
U2_13: length 7
  Top Layer w0.254: R14.1 15.49,80.9 15.49,78.44 15.75,78.19 U2.13
U2_14: length 4.9
  Top Layer w0.254: 14.62,78.87 14.84,78.65 14.84,78.44 15.09,78.19 U2.14
U2_15: length 7.1
  Top Layer w0.254: R12.1 13.94,80.85 13.94,78.44 14.44,77.93 U2.15
U2_16: length 5.1
  Top Layer w0.254: 13.79,74.12 13.79,77.68 13.03,78.44 R11.1
U2_17: length 7.2
  Top Layer w0.254: R10.1 12.38,80.8 12.38,78.44 13.15,77.68 U2.17
U2_18: length 5.2
  Top Layer w0.254: U2.18 12.5,77.68 11.48,78.69 11.48,78.81 11.42,78.87
U3_2: length 26.7
  Top Layer w0.254: U3.2 19.29,64.45 19.12,64.28 19.12,45.35 NOREF#21.40
U3_3: length 24.1
  Top Layer w0.254: 19.95,68.38 19.95,64.45 19.57,64.08 19.57,47.44 NOREF#28.41
U3_4: length 16.4
  Top Layer w0.254: 20.59,68.38 20.59,64.47 20.02,63.9 20.02,54.61 NOREF#7.44
U3_5: length 13.7
  Top Layer w0.254: U3.5 21.25,64.51 20.47,63.74 20.47,56.7 NOREF#61.45
U3_6: length 52.8
  Top Layer w0.254: v1(13.12,61.1) 13.12,60.95 12.97,60.8 12.97,31.54 NOREF#16.16 ; U3.6 21.92,66.95
  Bottom Layer w0.254: v1(13.12,61.1) 13.12,63.25 16.12,66.25 21.17,66.25 21.87,66.95 v1(21.92,66.95)
U3_7: length 55.9
  Top Layer w0.254: 13.77,60.55 13.42,60.2 13.42,29.45 NOREF#29.17 ; U3.7 v1(22.57,66.4)
  Bottom Layer w0.254: v1(22.57,66.4) 21.97,65.8 16.32,65.8 13.77,63.25 v1(13.77,60.55)
U3_8: length 64
  Top Layer w0.254: v1(14.42,61.1) 14.42,60.3 13.87,59.75 13.87,22.28 NOREF#34.20 ; U3.8 23.22,66.95
  Bottom Layer w0.254: v1(23.22,66.95) 23.22,66.1 22.47,65.35 16.52,65.35 14.42,63.25 v1(14.42,61.1)
U3_9: length 66.8
  Top Layer w0.254: U3.9 v1(23.87,66.4) ; NOREF#12.21 14.32,20.19 14.32,59.55 15.07,60.3 v1(15.07,60.55)
  Bottom Layer w0.254: v1(15.07,60.55) 15.07,63.25 16.72,64.9 22.72,64.9 23.87,66.05 v1(23.87,66.4)
U3_11: length 7.3
  Top Layer w0.254: R24.1 23.37,78.8 24.5,77.67 U3.11
U3_12: length 5.3
  Top Layer w0.254: U3.12 23.84,77.64 22.62,78.87
U3_13: length 7.4
  Top Layer w0.254: R22.1 21.93,80.86 21.93,78.44 23.19,77.17 U3.13
U3_14: length 5.4
  Top Layer w0.254: 22.54,74.12 22.54,76.92 21.02,78.44 R21.1
U3_15: length 7.5
  Top Layer w0.254: R20.1 20.37,80.82 20.37,78.44 21.9,76.92 21.9,74.12
U3_16: length 5.5
  Top Layer w0.254: 19.42,78.87 19.47,78.82 19.47,78.69 21.25,76.92 U3.16
U3_17: length 7.7
  Top Layer w0.254: R18.1 18.82,80.77 18.82,78.44 20.59,76.66 U3.17
U3_18: length 5.6
  Top Layer w0.254: 17.82,78.87 17.91,78.77 17.91,78.69 19.94,76.66 U3.18

## Text on the board
Bottom Silkscreen Layer: Pins: / 0-15 / 18-19 / 22-23 / 24-25 / 28-29
Top Silkscreen Layer: TeensyPixel 1.0 | Camdan Mead - www.camdan.me | Simultaneously controls up to 24 NeoPixel strands with a Teensy 4.1 | 2 | 3 | 1

# Board PCB v2
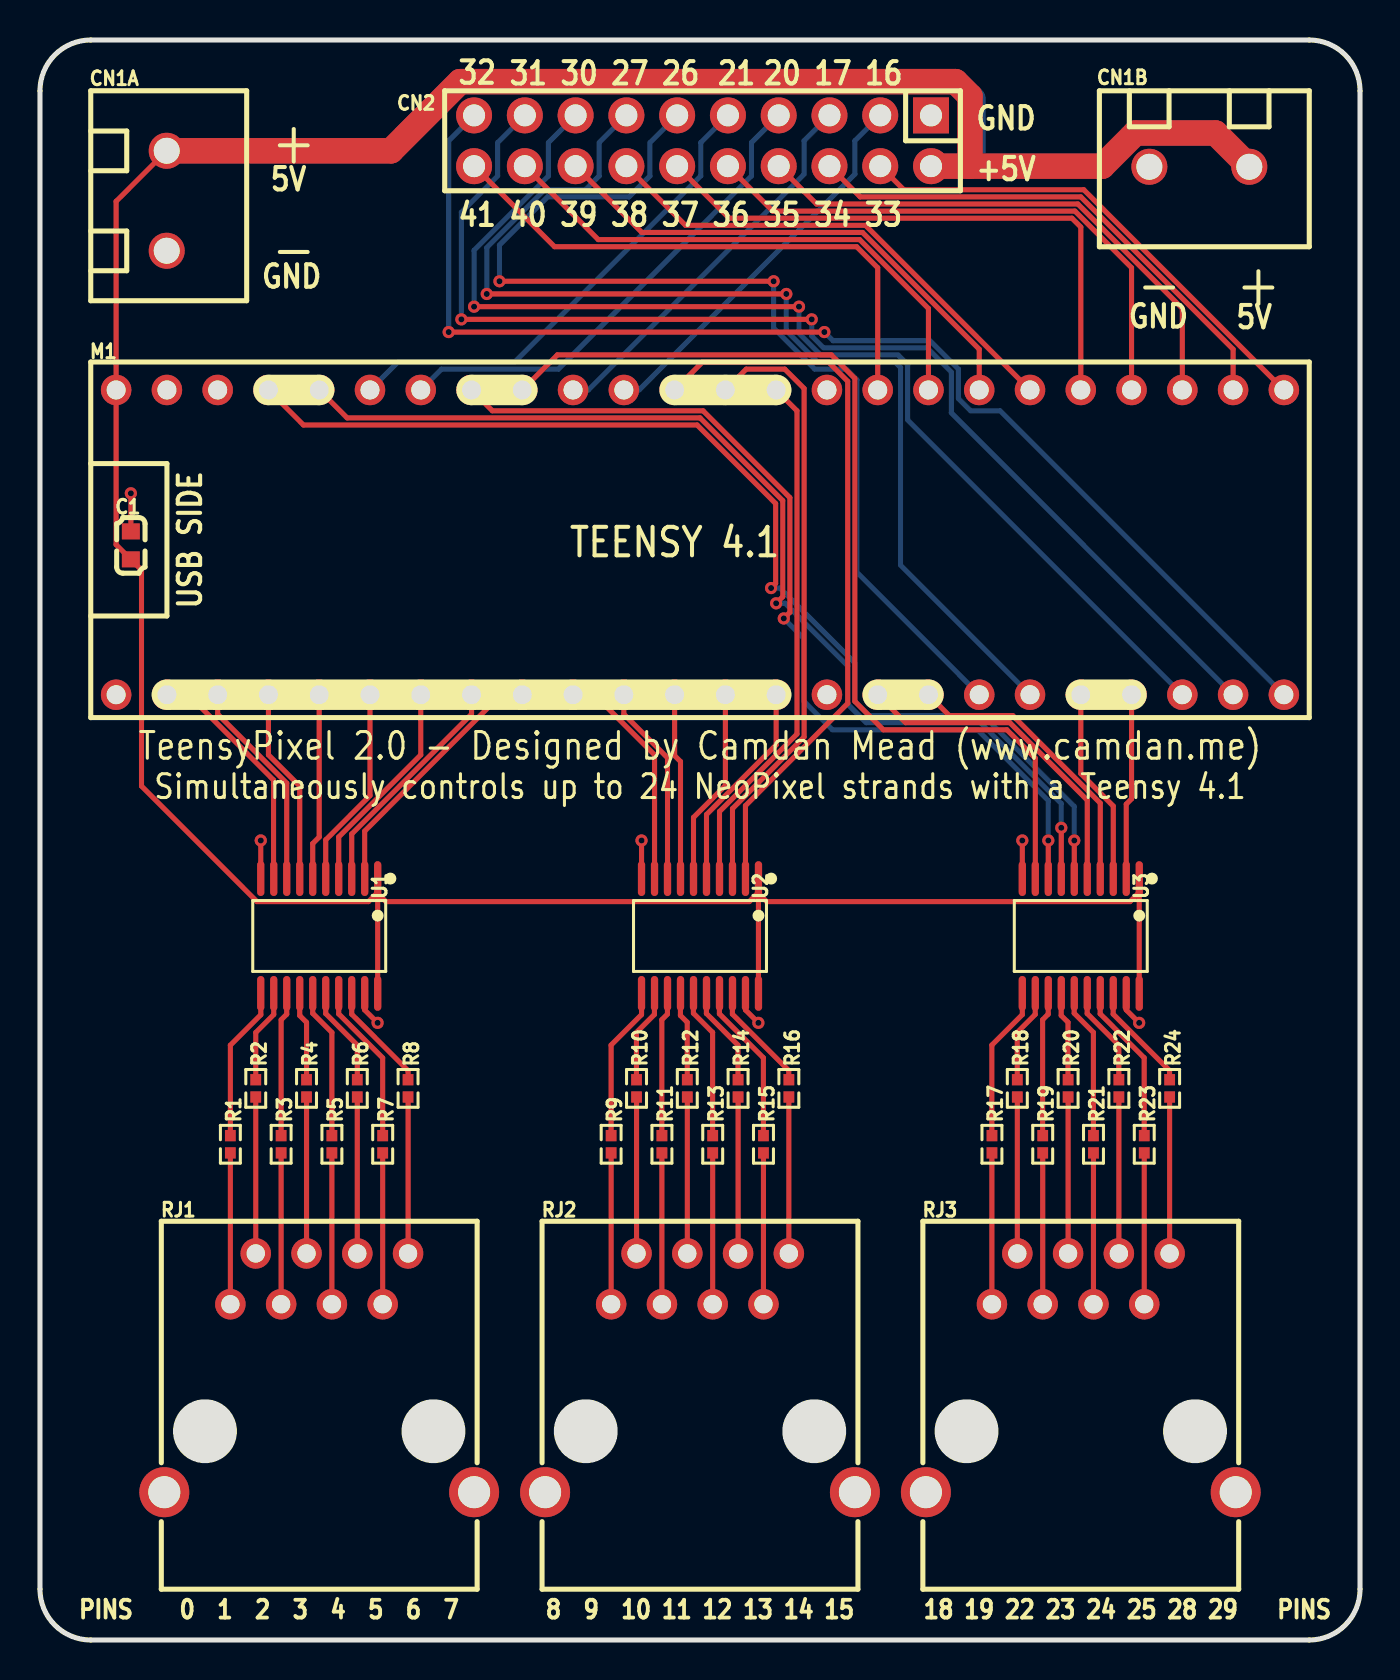
[diagram p4: board, top side]
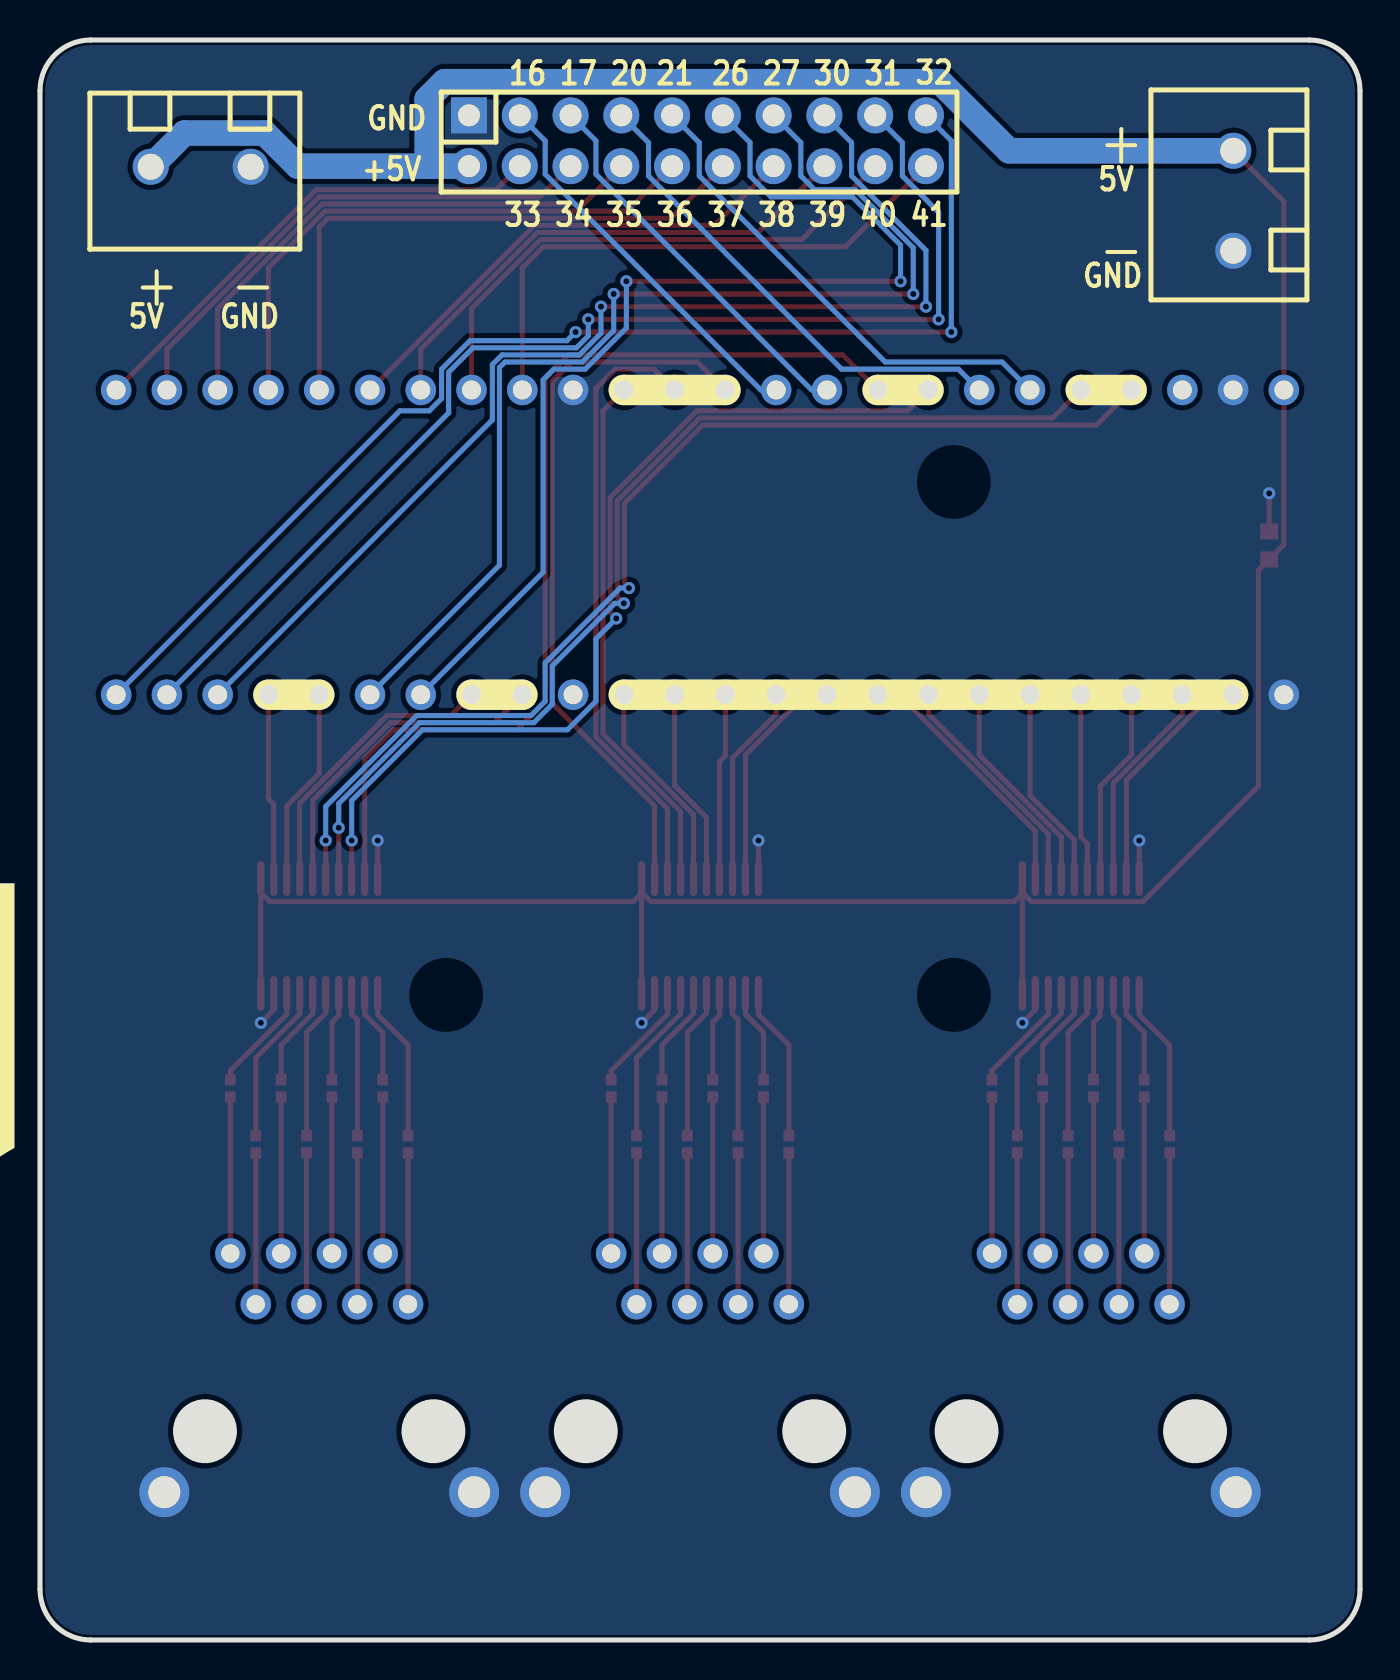
[diagram p5: board, bottom side, seen from below]

Outline 66.04 x 80.01 mm; copper layers: Top Layer, Bottom Layer. Coordinates in mm from the lower left corner of the outline.
Outline path: 0,77.47 0,2.54 arc(0.74,0.74) 2.54,0 63.5,0 arc(65.3,0.74) 66.04,2.54 66.04,77.47 arc(65.3,79.27) 63.5,80.01 2.54,80.01 arc(0.74,79.27) 0,77.47
Stack: Top Layer 0.035mm / Dielectric1 1.51mm FR4 er 4.5 / Bottom Layer 0.035mm

## Design rules (mm)
template: Custom Config
spacing copperThickness1oz (default): track to track 0.102, other pairs 0.152 to 0.3
spacing copperThickness2oz: track to track 0.203, other pairs 0.152 to 0.3
track width copperThickness1oz (default): min 0.127, default 0.254, max 2.54
track width copperThickness2oz: min 0.203, default 0.254, max 2.54
differential pair differentialPair (default): width min 0.127, default 0.254, max 2.54; gap min 0.152, default 0.152
via viaSize (default): diameter min 0.5, default 0.61, max 10; hole min 0.3, default 0.305, max 6.3
net GND uses groundPlane

## Placement (name value [footprint] x y rotation side)
C1  1uF  [C0603]  4.55 54.74 270 top
CN1A  MX126-5.0-02P-GN01-Cu-S-A  [CONN-TH_2P-P5.00_MX126-5.0-GN01-02P-CU-S-A]  6.34 71.97 270 top
CN1B  MX126-5.0-02P-GN01-Cu-S-A  [CONN-TH_2P-P5.00_MX126-5.0-GN01-02P-CU-S-A]  58 73.67 180 top
CN2  PM254-2-10-Z-8.5  [HDR-TH_20P-P2.54-V-F-R2-C10-S2.54]  33.15 74.97 180 top
M1  -  [TEENSY4.1 - KBB]  31.75 54.89 90 top
R1  100Ω  [R0402]  9.53 24.79 270 top
R2  100Ω  [R0402]  10.79 27.58 270 top
R3  100Ω  [R0402]  12.06 24.79 270 top
R4  100Ω  [R0402]  13.34 27.58 270 top
R5  100Ω  [R0402]  14.6 24.79 270 top
R6  100Ω  [R0402]  15.88 27.58 270 top
R7  100Ω  [R0402]  17.15 24.79 270 top
R8  100Ω  [R0402]  18.41 27.58 270 top
R9  100Ω  [R0402]  28.57 24.79 270 top
R10  100Ω  [R0402]  29.84 27.58 270 top
R11  100Ω  [R0402]  31.12 24.79 270 top
R12  100Ω  [R0402]  32.38 27.58 270 top
R13  100Ω  [R0402]  33.66 24.79 270 top
R14  100Ω  [R0402]  34.93 27.58 270 top
R15  100Ω  [R0402]  36.19 24.79 270 top
R16  100Ω  [R0402]  37.47 27.58 270 top
R17  100Ω  [R0402]  47.62 24.79 270 top
R18  100Ω  [R0402]  48.9 27.58 270 top
R19  100Ω  [R0402]  50.16 24.79 270 top
R20  100Ω  [R0402]  51.44 27.58 270 top
R21  100Ω  [R0402]  52.71 24.79 270 top
R22  100Ω  [R0402]  53.97 27.58 270 top
R23  100Ω  [R0402]  55.25 24.79 270 top
R24  100Ω  [R0402]  56.51 27.58 270 top
RJ1  R-RJ45R10P-B000  [RJ45-TH_R-RJ45R10P-B000]  13.97 13.36 180 top
RJ2  R-RJ45R10P-B000  [RJ45-TH_R-RJ45R10P-B000]  33.02 13.36 180 top
RJ3  R-RJ45R10P-B000  [RJ45-TH_R-RJ45R10P-B000]  52.07 13.36 180 top
U1  SN74HCT245PWR  [TSSOP-20_L6.5-W4.4-P0.65-LS6.4-BL]  13.97 35.2 180 top
U2  SN74HCT245PWR  [TSSOP-20_L6.5-W4.4-P0.65-LS6.4-BL]  33.02 35.2 180 top
U3  SN74HCT245PWR  [TSSOP-20_L6.5-W4.4-P0.65-LS6.4-BL]  52.07 35.2 180 top

## Footprints (pads in the part's own frame, mm; a bottom-side part is the same pattern mirrored in y, then rotated)
C0603
  rect 0.8x0.9 smd: 1(-0.7,0) 2(0.7,0)
CONN-TH_2P-P5.00_MX126-5.0-GN01-02P-CU-S-A
  round 1.8 hole 1.3: 1(-2.5,0) 2(2.5,0)
HDR-TH_20P-P2.54-V-F-R2-C10-S2.54
  rect 1.8x1.8 hole 1.1: 1(-11.43,-1.27)
  round 1.8 hole 1.1: 2(-11.43,1.27) 3(-8.89,-1.27) 4(-8.89,1.27) 5(-6.35,-1.27) 6(-6.35,1.27) 7(-3.81,-1.27) 8(-3.81,1.27) 9(-1.27,-1.27) 10(-1.27,1.27) 11(1.27,-1.27) 12(1.27,1.27) 13(3.81,-1.27) 14(3.81,1.27) 15(6.35,-1.27) 16(6.35,1.27) 17(8.89,-1.27) 18(8.89,1.27) 19(11.43,-1.27) 20(11.43,1.27)
R0402
  rect 0.566x0.54 smd: 1(-0.433,0) 2(0.433,0)
RJ45-TH_R-RJ45R10P-B000
  round 1.524 hole 0.914: 1(4.445,-3.43) 2(3.175,-5.97) 3(1.905,-3.43) 4(0.635,-5.97) 5(-0.635,-3.43) 6(-1.905,-5.97) 7(-3.175,-3.43) 8(-4.445,-5.97)
  round 2.5 hole 1.6: 9(7.75,5.97) 10(-7.75,5.97)
TEENSY4.1 - KBB
  round 1.524 hole 0.95: 0(-7.62,25.4) 1(-7.62,22.86) 2(-7.62,20.32) 3(-7.62,17.78) 3V3(-7.62,-7.62) 3V3(7.62,22.86) 4(-7.62,15.24) 5(-7.62,12.7) 6(-7.62,10.16) 7(-7.62,7.62) 8(-7.62,5.08) 9(-7.62,2.54) 10(-7.62,0) 11(-7.62,-2.54) 12(-7.62,-5.08) 13(7.62,-5.08) 14(7.62,-2.54) 15(7.62,0) 16(7.62,2.54) 17(7.62,5.08) 18(7.62,7.62) 19(7.62,10.16) 20(7.62,12.7) 21(7.62,15.24) 22(7.62,17.78) 23(7.62,20.32) 24(-7.62,-10.16) 25(-7.62,-12.7) 26(-7.62,-15.24) 27(-7.62,-17.78) 28(-7.62,-20.32) 29(-7.62,-22.86) 30(-7.62,-25.4) 31(-7.62,-27.94) 32(-7.62,-30.48) 33(7.62,-30.48) 34(7.62,-27.94) 35(7.62,-25.4) 36(7.62,-22.86) 37(7.62,-20.32) 38(7.62,-17.78) 39(7.62,-15.24) 40(7.62,-12.7) 41(7.62,-10.16) AGND(7.62,25.4) GND(-7.62,27.94) GND(7.62,-7.62) VIN(7.62,27.94)
TSSOP-20_L6.5-W4.4-P0.65-LS6.4-BL
  oval 0.364x1.742 smd: 1(-2.925,-2.871) 2(-2.275,-2.871) 3(-1.625,-2.871) 4(-0.975,-2.871) 5(-0.325,-2.871) 6(0.325,-2.871) 7(0.975,-2.871) 8(1.625,-2.871) 9(2.275,-2.871) 10(2.925,-2.871) 11(2.925,2.871) 12(2.275,2.871) 13(1.625,2.871) 14(0.975,2.871) 15(0.325,2.871) 16(-0.325,2.871) 17(-0.975,2.871) 18(-1.625,2.871) 19(-2.275,2.871) 20(-2.925,2.871)

## Nets
As in the schematic, except:
GND: C1.1 CN1A.2 CN1B.2 CN2.1 M1.AGND M1.GND RJ1.9 RJ1.10 RJ2.9 RJ2.10 RJ3.9 RJ3.10 U1.10 U1.19 U2.10 U2.19 U3.10 U3.19
VCC: C1.2 CN1A.1 CN1B.1 CN2.2 M1.VIN U1.1 U1.20 U2.1 U2.20 U3.1 U3.20

Pads without a net: M1 3V3

## Via types
v1: diameter 0.61, hole 0.305, Top Layer to Bottom Layer, 23 vias

## Routing (per net, layer and track width the routed paths; a pad name or vN(x,y) marks a point on that pad's centre or on a via; arc(x,y) is an arc through that point)
GND: length 12.8
  Top Layer w0.254: v1(16.89,30.86) 16.25,31.51 U1.19 ; v1(35.94,30.86) 35.29,31.51 U2.19 ; C1.1 v1(4.55,57.34) ; v1(54.99,30.86) 54.34,31.51 U3.19 ; U1.10 v1(11.04,39.98) ; U3.10 v1(49.15,39.98) ; U2.10 v1(30.09,39.98)
VCC: length 229.3
  Top Layer w0.254: 16.9,37.38 16.9,37.33 ; 16.9,37.38 16.44,36.93 10.85,36.93 5.08,42.7 5.08,53.5 C1.2 3.81,54.77 M1.VIN 3.81,71.94 CN1A.1 ; 16.9,37.38 U1.1 ; 16.9,37.33 17.3,36.93 35.49,36.93 35.94,37.38 ; 16.9,37.33 U1.20 ; 55,37.38 54.54,36.93 36.35,36.93 35.94,37.33 ; 55,37.38 U3.20 ; 55,37.38 U3.1 ; 35.94,37.38 35.94,37.33 ; 35.94,37.38 35.94,38.08 ; 35.94,37.33 35.94,32.33
  Top Layer w1.27: CN1A.1 17.56,74.47 21.02,77.93 45.8,77.93 46.53,77.2 46.53,73.7 ; 46.53,73.7 53.15,73.7 54.8,75.36 58.81,75.36 CN1B.1 ; 46.53,73.7 CN2.2
  Bottom Layer w1.27: CN1B.1 58.81,75.36 54.8,75.36 53.15,73.7 46.67,73.7 ; 46.67,73.7 CN2.2 ; 46.67,73.7 46.67,77.06 45.8,77.93 21.02,77.93 17.56,74.47 CN1A.1
PIN16: length 19.5
  Bottom Layer w0.254: M1.16 29.97,62.51 40.77,73.3 40.77,74.97 CN2.3
PIN17: length 19.5
  Bottom Layer w0.254: M1.17 27.43,62.51 38.23,73.3 38.23,74.97 CN2.5
PIN20: length 24.6
  Bottom Layer w0.254: M1.20 20.09,63.55 25.93,63.55 35.6,73.21 35.6,74.88 CN2.7
PIN21: length 24.6
  Bottom Layer w0.254: M1.21 17.91,63.91 23.75,63.91 33.06,73.21 33.06,74.88 CN2.9
PIN26: length 53.9
  Top Layer w0.254: v1(36.7,67.94) v1(22.99,67.94)
  Bottom Layer w0.254: v1(36.7,67.94) 36.7,65.61 38.76,63.55 40.34,63.55 40.87,63.02 40.87,53.39 M1.26 ; v1(22.99,67.94) 22.99,69.76 25.4,72.17 29.47,72.17 30.52,73.21 30.52,74.88 CN2.11
PIN27: length 55.4
  Top Layer w0.254: v1(22.35,67.31) v1(37.34,67.31)
  Bottom Layer w0.254: M1.27 43.05,53.75 43.05,63.63 42.78,63.91 38.91,63.91 37.34,65.48 v1(37.34,67.31) ; CN2.13 27.98,74.88 27.98,73.21 27.29,72.52 25.25,72.52 22.35,69.62 v1(22.35,67.31)
PIN30: length 57.5
  Top Layer w0.254: v1(21.72,66.67) v1(37.97,66.67)
  Bottom Layer w0.254: v1(21.72,66.67) 21.72,69.49 25.44,73.21 25.44,74.88 CN2.15 ; M1.30 43.41,61.01 43.41,63.78 42.93,64.26 39.06,64.26 37.97,65.34 v1(37.97,66.67)
PIN31: length 59.6
  Top Layer w0.254: v1(21.08,66.04) v1(38.61,66.04)
  Bottom Layer w0.254: CN2.17 22.9,74.88 22.9,73.21 21.08,71.4 v1(21.08,66.04) ; M1.31 45.59,61.37 45.59,63.4 44.38,64.62 39.2,64.62 38.61,65.21 v1(38.61,66.04)
PIN32: length 61.5
  Top Layer w0.254: v1(20.45,65.4) v1(39.24,65.4)
  Bottom Layer w0.254: v1(39.24,65.4) 39.68,64.97 44.53,64.97 45.95,63.55 45.95,62.08 46.56,61.47 48.03,61.47 M1.32 ; CN2.19 20.45,74.97 v1(20.45,65.4)
PIN33: length 24.8
  Top Layer w0.254: CN2.4 43.22,72.52 52.22,72.52 M1.33
PIN34: length 26
  Top Layer w0.254: M1.34 59.69,64.55 52.07,72.17 41.03,72.17 CN2.6
PIN35: length 27.2
  Top Layer w0.254: M1.35 57.15,66.58 51.92,71.81 38.85,71.81 CN2.8
PIN36: length 28.4
  Top Layer w0.254: CN2.10 36.66,71.45 51.78,71.45 54.61,68.62 M1.36
PIN37: length 29.6
  Top Layer w0.254: M1.37 52.07,70.66 51.63,71.1 34.48,71.1 CN2.12
PIN38: length 24.8
  Top Layer w0.254: CN2.14 32.3,70.74 41.3,70.74 M1.38
PIN39: length 26
  Top Layer w0.254: M1.39 46.99,64.55 41.15,70.39 30.11,70.39 CN2.16
PIN40: length 27.2
  Top Layer w0.254: M1.40 44.45,66.58 41,70.03 27.93,70.03 CN2.18
PIN41: length 28.4
  Top Layer w0.254: CN2.20 25.74,69.67 40.86,69.67 41.91,68.62 M1.41
PWM1: length 12
  Top Layer w0.254: M1.0 7.42,47.27 11.68,43 11.68,38.09 U1.9
PWM2: length 10.6
  Top Layer w0.254: M1.1 8.89,46.3 12.34,42.84 U1.8
PWM3: length 9.8
  Top Layer w0.254: M1.2 11.43,44.26 13,42.7 U1.7
PWM4: length 9.6
  Top Layer w0.254: U1.6 13.65,39.83 13.97,40.15 M1.3 14.15,47.09
PWM5: length 10.1
  Top Layer w0.254: U1.5 14.29,40.01 16.51,42.23 M1.4
PWM6: length 10.9
  Top Layer w0.254: M1.5 19.05,44.26 14.94,40.16 U1.4
PWM7: length 11.7
  Top Layer w0.254: M1.6 21.59,46.3 15.59,40.3 U1.3
PWM8: length 13.1
  Top Layer w0.254: M1.7 23.06,47.27 16.25,40.45 U1.2
PWM9: length 11.5
  Top Layer w0.254: M1.8 27.74,47.27 30.75,44.26 U2.9
PWM10: length 10.1
  Top Layer w0.254: U2.8 31.4,44.11 29.21,46.3 M1.9
PWM11: length 9.3
  Top Layer w0.254: 32.04,38.08 32.04,43.93 31.75,44.22 M1.10
PWM12: length 9.9
  Top Layer w0.254: U2.6 32.69,41.13 34.29,42.73 M1.11
PWM13: length 10.6
  Top Layer w0.254: U2.5 33.34,41.28 36.83,44.77 M1.12
PWM14: length 26.5
  Top Layer w0.254: M1.13 37.87,61.47 37.87,45.3 34,41.43 U2.4
PWM15: length 30.8
  Top Layer w0.254: U2.3 34.65,41.57 38.23,45.16 38.23,62.58 37.26,63.55 35.33,63.55 M1.14
PWM16: length 36.6
  Top Layer w0.254: M1.15 33.15,63.91 39.44,63.91 40.41,62.94 40.41,46.84 35.29,41.72 U2.2
PWM17: length 50.2
  Top Layer w0.254: M1.18 25.88,64.26 39.59,64.26 40.77,63.09 40.77,46.94 42.19,45.52 48.37,45.52 49.79,44.09 U3.9
PWM18: length 47.1
  Top Layer w0.254: v1(50.44,39.98) U3.8 ; M1.19 22.63,61.47 33.17,61.47 37.52,57.12 37.52,51.39 v1(37.21,51.08)
  Bottom Layer w0.254: v1(37.21,51.08) 37.21,51.08 38.23,50.06 38.23,46.94 39.65,45.52 46.9,45.52 50.44,41.98 v1(50.44,39.98)
PWM19: length 54
  Top Layer w0.254: v1(36.83,51.84) 37.16,52.17 37.16,56.98 33.03,61.11 15.37,61.11 M1.22 ; v1(51.09,40.62) U3.7
  Bottom Layer w0.254: v1(51.09,40.62) 51.09,41.83 47.05,45.87 41.33,45.87 40.41,46.79 40.41,48.71 37.28,51.84 v1(36.83,51.84)
PWM20: length 56.5
  Top Layer w0.254: v1(36.58,52.6) 36.8,52.83 36.8,56.83 32.88,60.76 13.18,60.76 M1.23 ; v1(51.75,39.98) U3.6
  Bottom Layer w0.254: v1(36.58,52.6) 37.02,52.6 40.77,48.86 40.77,46.94 41.48,46.23 47.2,46.23 51.75,41.68 v1(51.75,39.98)
PWM21: length 16.6
  Top Layer w0.254: 52.4,38.08 52.4,42 48.52,45.87 43.31,45.87 M1.24
PWM22: length 14.6
  Top Layer w0.254: M1.25 45.49,46.23 48.67,46.23 53.04,41.85 U3.4
PWM23: length 9.9
  Top Layer w0.254: U3.3 53.69,41.7 52.07,43.33 M1.28
PWM24: length 9.3
  Top Layer w0.254: M1.29 54.61,42.06 54.34,41.8 U3.2
$1N2556: length 5
  Top Layer w0.254: R6.1 15.88,29.74 14.29,31.32 U1.16
$1N2587: length 7.8
  Top Layer w0.254: R4.2 RJ1.4
$1N2597: length 7.6
  Top Layer w0.254: R5.2 RJ1.5
$1N2607: length 7.8
  Top Layer w0.254: R6.2 RJ1.6
$1N2633: length 7.8
  Top Layer w0.254: R2.2 RJ1.2
$1N2634: length 7.6
  Top Layer w0.254: R3.2 RJ1.3
$1N2643: length 7.6
  Top Layer w0.254: R1.2 RJ1.1
$1N2648: length 7.6
  Top Layer w0.254: R7.2 RJ1.7
$1N2658: length 7.8
  Top Layer w0.254: R8.2 RJ1.8
$1N3149: length 4.7
  Top Layer w0.254: 30.74,32.34 30.74,31.28 29.84,30.38 29.84,28.02
$1N3165: length 7.8
  Top Layer w0.254: R12.2 32.38,19.33
$1N3169: length 7.6
  Top Layer w0.254: R13.2 RJ2.5
$1N3173: length 7.8
  Top Layer w0.254: R14.2 RJ2.6
$1N3177: length 7.8
  Top Layer w0.254: R10.2 RJ2.2
$1N3181: length 7.6
  Top Layer w0.254: R11.2 RJ2.3
$1N3185: length 7.6
  Top Layer w0.254: R9.2 RJ2.1
$1N3189: length 7.8
  Top Layer w0.254: R16.2 RJ2.8
$1N3193: length 7.6
  Top Layer w0.254: R15.2 RJ2.7
$1N3678: length 7.8
  Top Layer w0.254: R20.2 RJ3.4
$1N3682: length 7.6
  Top Layer w0.254: R21.2 RJ3.5
$1N3686: length 7.8
  Top Layer w0.254: R22.2 RJ3.6
$1N3690: length 7.8
  Top Layer w0.254: R18.2 48.9,19.33
$1N3694: length 7.6
  Top Layer w0.254: R19.2 RJ3.3
$1N3698: length 7.6
  Top Layer w0.254: R17.2 RJ3.1
$1N3702: length 7.8
  Top Layer w0.254: R24.2 RJ3.8
$1N3706: length 7.6
  Top Layer w0.254: R23.2 RJ3.7
$1N9639: length 7.7
  Top Layer w0.254: U1.11 11.05,32.33 11.05,31.27 9.53,29.74 9.53,25.22
$1N9644: length 4.7
  Top Layer w0.254: R2.1 10.79,30.38 11.69,31.28 U1.12
$1N9649: length 7.2
  Top Layer w0.254: U1.13 12.34,31.29 12.06,31.01 12.06,25.22
$1N9654: length 4.5
  Top Layer w0.254: U1.14 13,31.23 13.34,30.89 R4.1
$1N9659: length 7.5
  Top Layer w0.254: 14.6,25.22 14.6,30.38 13.65,31.34 U1.15
$1N9677: length 8
  Top Layer w0.254: U1.17 14.94,31.31 17.15,29.11 17.15,25.22
$1N9682: length 5.5
  Top Layer w0.254: R8.1 18.41,28.47 15.59,31.29 U1.18
$1N9744: length 7.7
  Top Layer w0.254: 28.57,25.23 28.57,29.75 30.09,31.27 U2.11 30.09,32.34
$1N9765: length 7.2
  Top Layer w0.254: 31.39,32.34 31.39,31.3 31.11,31.02 31.11,25.23
$1N9770: length 4.5
  Top Layer w0.254: 32.38,28.02 32.38,30.89 32.04,31.23 32.04,32.34
$1N9775: length 7.5
  Top Layer w0.254: 33.65,25.23 33.65,30.38 32.69,31.34 32.69,32.34
$1N9780: length 5
  Top Layer w0.254: 34.92,28.02 34.92,29.75 33.34,31.33 33.34,32.34
$1N9785: length 8
  Top Layer w0.254: 36.19,25.23 36.19,29.11 33.99,31.31 33.99,32.34
$1N9790: length 5.5
  Top Layer w0.254: 37.46,28.02 37.46,28.48 34.64,31.3 34.64,32.34
$1N9844: length 7.7
  Top Layer w0.254: 47.62,25.23 47.62,29.75 49.15,31.27 U3.11 49.14,32.34
$1N9849: length 4.7
  Top Layer w0.254: 48.89,28.02 48.89,30.38 49.79,31.28 49.79,32.34
$1N9854: length 7.2
  Top Layer w0.254: 50.44,32.34 50.44,31.3 50.16,31.02 50.16,25.23
$1N9859: length 4.5
  Top Layer w0.254: 51.09,32.34 51.09,31.23 51.43,30.89 51.43,28.02
$1N9864: length 7.5
  Top Layer w0.254: 51.74,32.34 51.74,31.34 52.7,30.38 52.7,25.23
$1N9869: length 5
  Top Layer w0.254: 53.97,28.02 53.97,29.75 52.39,31.33 52.39,32.34
$1N9874: length 8
  Top Layer w0.254: 53.04,32.34 53.04,31.31 55.24,29.11 55.24,25.23
$1N9879: length 5.5
  Top Layer w0.254: 56.51,28.02 56.51,28.48 53.69,31.3 53.69,32.34

## Copper pours and planes (outline as drawn; the poured copper is in the pictures)
GND on Bottom Layer: 0,80.01 66.04,80.01 66.04,0 0,0

## Text on the board
Bottom Silkscreen Layer: 5V | +5V | GND | 32 | 41 | 31 | 40 | 30 | 39 | 27 | 38 | 26 | 37 | 36 | 21 | 20 | 35 | 17 | 34 | 16 | 33 | + | -
Top Silkscreen Layer: PINS | 0  1  2  3  4  5  6  7 | 8  9  10 11 12 13 14 15 | 18 19 22 23 24 25 28 29 | GND | 32 | 41 | 40 | 31 | 39 | 30 | 38 | 27 | 37 | 26 | 36 | 21 | 35 | 20 | 34 | 17 | 33 | 16 | USB SIDE | 5V | +5V | Simultaneously controls up to 24 NeoPixel strands with a Teensy 4.1 | TeensyPixel 2.0 - Designed by Camdan Mead (www.camdan.me) | TEENSY 4.1 | + | -
